# Altium project LPCB220__RLOOP__STEPPER_NODE.PrjPCB (part 1 of 2)
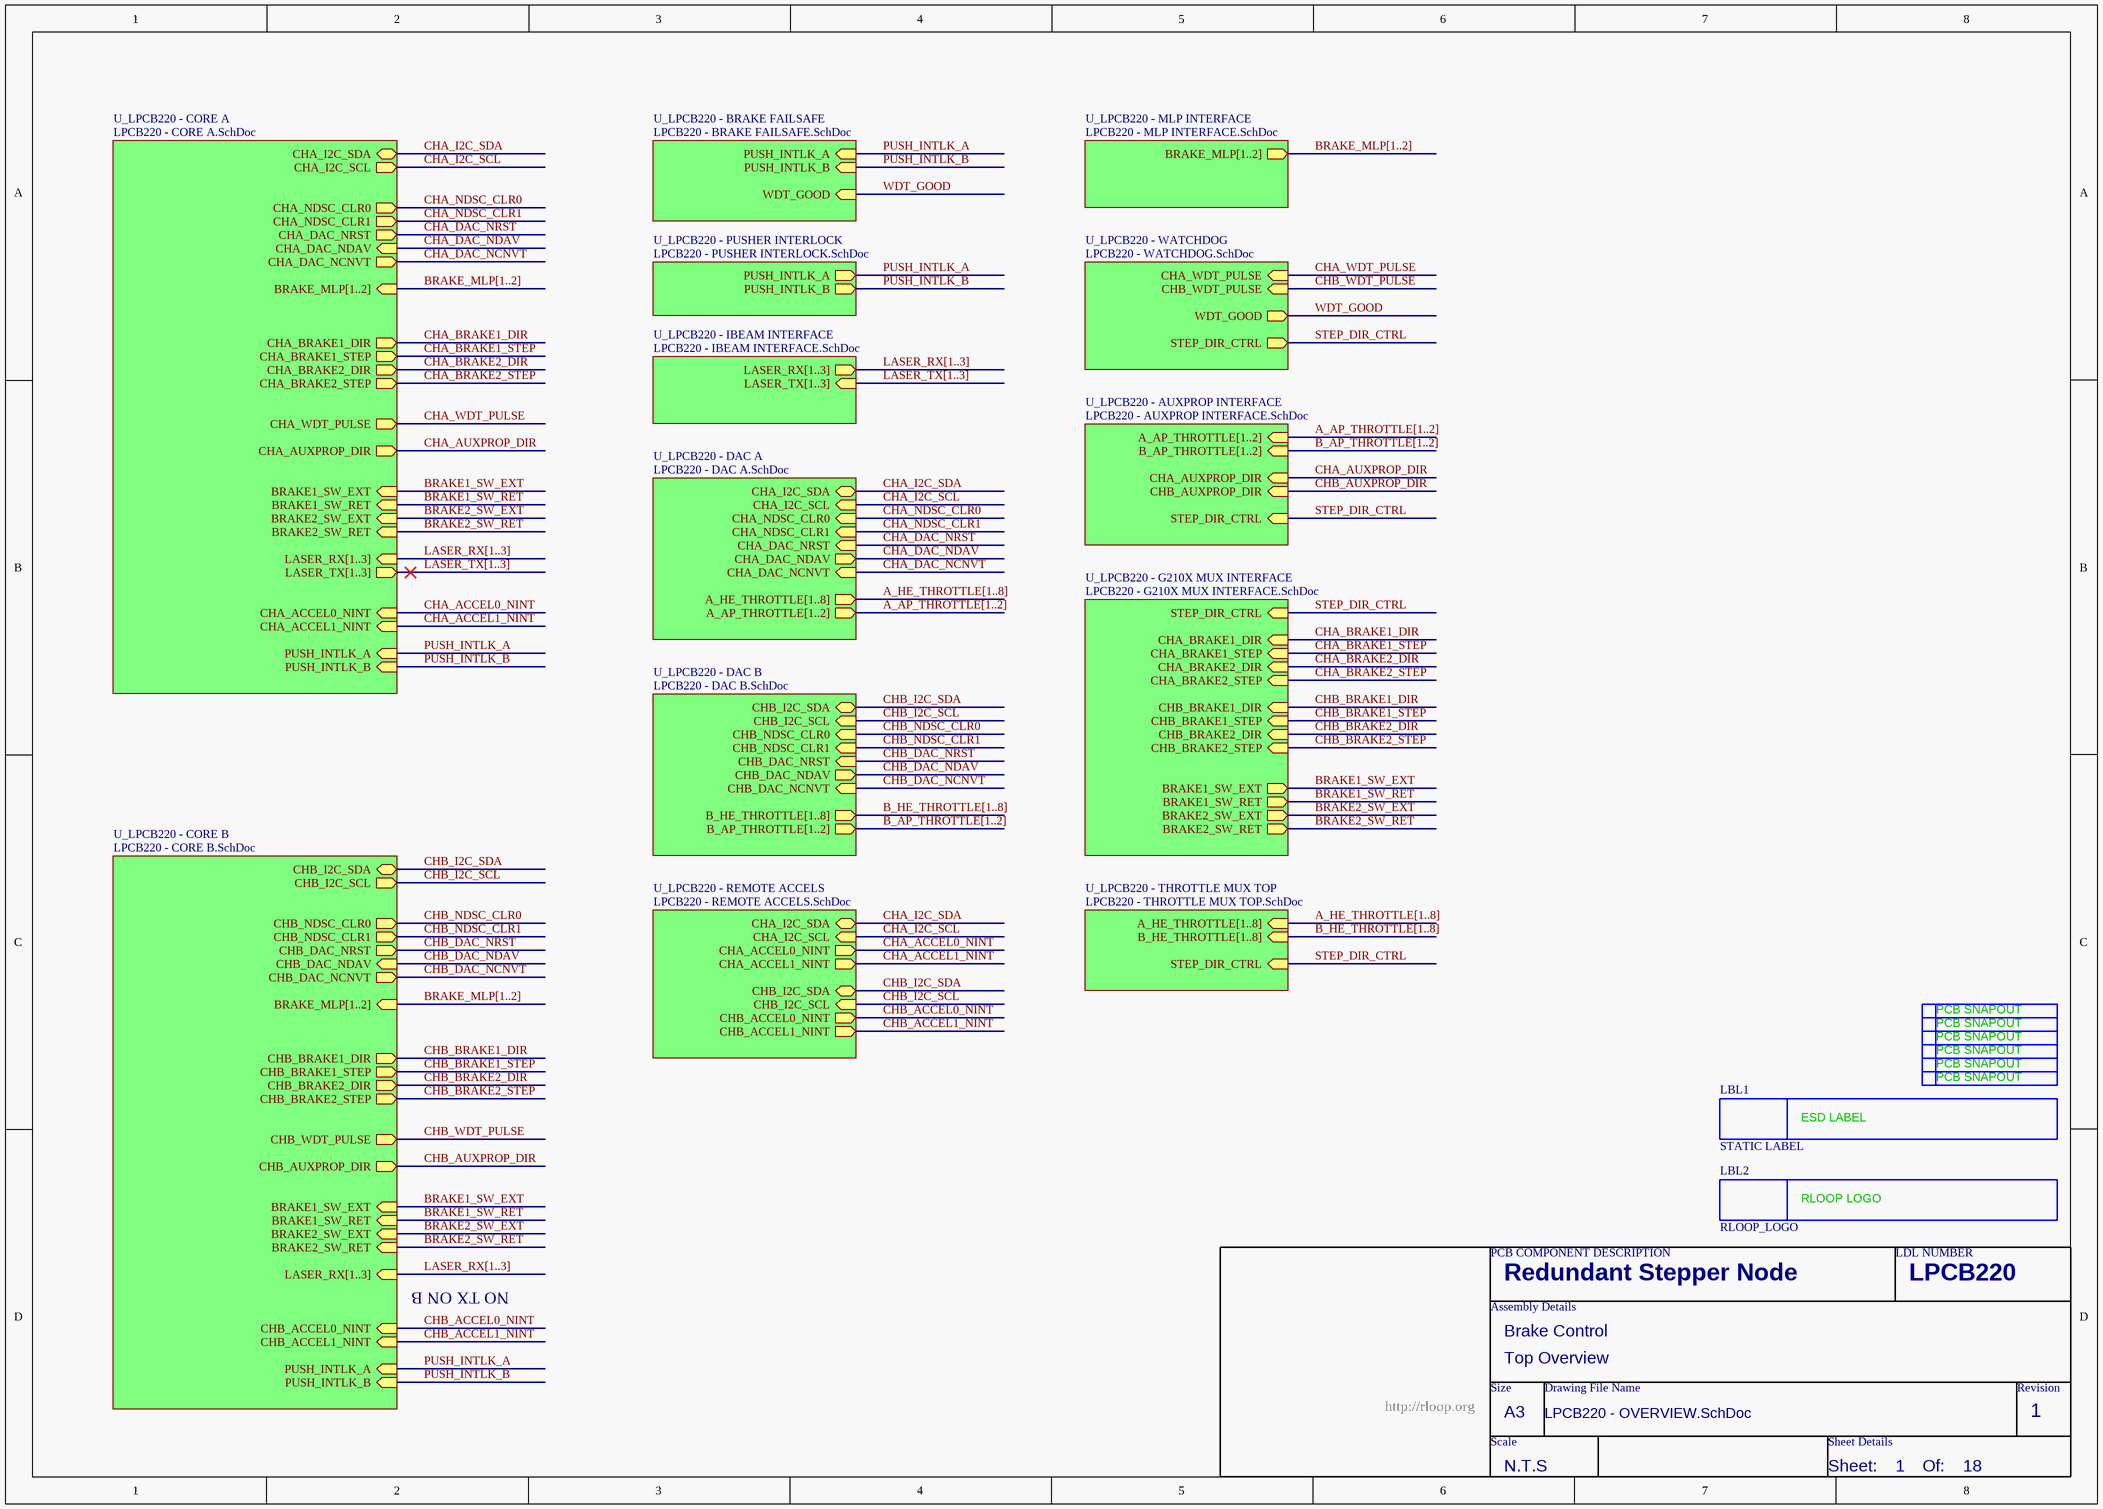
[diagram p0: LPCB220 - OVERVIEW.SchDoc]
18 sheets, 229 parts. Net scope: hierarchical (ports join the sheet entries above them; power ports are global).
Board files: LPCB220R0.PcbDoc, LPCB220R0__ASCII.PcbDoc
Sheets:
  LPCB220 - OVERVIEW.SchDoc
    U_LPCB220 - BRAKE FAILSAFE = LPCB220 - BRAKE FAILSAFE.SchDoc
    U_LPCB220 - WATCHDOG = LPCB220 - WATCHDOG.SchDoc
    U_LPCB220 - MLP INTERFACE = LPCB220 - MLP INTERFACE.SchDoc
      BL1 = LPCB220 - BRAKE MLP CHANNEL.SchDoc
      BL2 = LPCB220 - BRAKE MLP CHANNEL.SchDoc
    U_LPCB220 - PUSHER INTERLOCK = LPCB220 - PUSHER INTERLOCK.SchDoc
    U_LPCB220 - AUXPROP INTERFACE = LPCB220 - AUXPROP INTERFACE.SchDoc
    U_LPCB220 - DAC A = LPCB220 - DAC A.SchDoc
    U_LPCB220 - DAC B = LPCB220 - DAC B.SchDoc
    U_LPCB220 - IBEAM INTERFACE = LPCB220 - IBEAM INTERFACE.SchDoc
      L1 = LPCB220 - LASER CHANNEL.SchDoc
      L2 = LPCB220 - LASER CHANNEL.SchDoc
      L3 = LPCB220 - LASER CHANNEL.SchDoc
    U_LPCB220 - CORE A = LPCB220 - CORE A.SchDoc
    U_LPCB220 - REMOTE ACCELS = LPCB220 - REMOTE ACCELS.SchDoc
    U_LPCB220 - CORE B = LPCB220 - CORE B.SchDoc
    U_LPCB220 - G210X MUX INTERFACE = LPCB220 - G210X MUX INTERFACE.SchDoc
    U_LPCB220 - THROTTLE MUX TOP = LPCB220 - THROTTLE MUX TOP.SchDoc
      TH1 = LPCB220 - THROTTLE ISO CHANNEL.SchDoc
      TH2 = LPCB220 - THROTTLE ISO CHANNEL.SchDoc
      TH3 = LPCB220 - THROTTLE ISO CHANNEL.SchDoc
      TH4 = LPCB220 - THROTTLE ISO CHANNEL.SchDoc
      TH5 = LPCB220 - THROTTLE ISO CHANNEL.SchDoc
      TH6 = LPCB220 - THROTTLE ISO CHANNEL.SchDoc
      TH7 = LPCB220 - THROTTLE ISO CHANNEL.SchDoc
      TH8 = LPCB220 - THROTTLE ISO CHANNEL.SchDoc
      U_LPCB220 - THROTTLE CONNECTORS = LPCB220 - THROTTLE CONNECTORS.SchDoc

## Sheet LPCB220 - OVERVIEW.SchDoc
size A3; Address1: Factory 10; Address2: 9-13 Dingley Avenue, Dandeong, VICTORIA 3175, AUSTRALIA; DocumentNumber: 1; Revision: 1; SheetNumber: 1; SheetTotal: 18; Lockie__PCB_SUB_ASSEMBLY: Top Overview; Lockie__PCB_ASSEMBLY: Brake Control; Lockie__LDL: LPCB220; Lockie__PCB_DESCRIPTION: Redundant Stepper Node

### Parts
LBL1  STATIC LABEL  [STATIC_LABEL]  (no BOM)
LBL2  RLOOP_LOGO  [RLOOP_LOGO]  (no BOM)
SN1  PCB_SNAPOUT  [SNAPOUT_NEW]  (value not drawn)  (no BOM)
SN2  PCB_SNAPOUT  [SNAPOUT_NEW]  (value not drawn)  (no BOM)
SN3  PCB_SNAPOUT  [SNAPOUT_NEW]  (value not drawn)  (no BOM)
SN4  PCB_SNAPOUT  [SNAPOUT_NEW]  (value not drawn)  (no BOM)
SN5  PCB_SNAPOUT  [SNAPOUT_NEW]  (value not drawn)  (no BOM)
SN6  PCB_SNAPOUT  [SNAPOUT_NEW]  (value not drawn)  (no BOM)

### Sub-sheets
U_LPCB220 - AUXPROP INTERFACE = LPCB220 - AUXPROP INTERFACE.SchDoc: B_AP_THROTTLE[1..2] (in), A_AP_THROTTLE[1..2] (in), CHB_AUXPROP_DIR (in), CHA_AUXPROP_DIR (in), STEP_DIR_CTRL (in)
U_LPCB220 - BRAKE FAILSAFE = LPCB220 - BRAKE FAILSAFE.SchDoc: PUSH_INTLK_A (in), PUSH_INTLK_B (in), WDT_GOOD (in)
U_LPCB220 - CORE A = LPCB220 - CORE A.SchDoc: CHA_I2C_SDA (bidir), CHA_I2C_SCL (out), LASER_TX[1..3] (out), LASER_RX[1..3] (in), CHA_ACCEL0_NINT (in), CHA_ACCEL1_NINT (in), CHA_AUXPROP_DIR (out), CHA_DAC_NDAV (in), BRAKE1_SW_EXT (in), BRAKE1_SW_RET (in), BRAKE_MLP[1..2] (in), CHA_NDSC_CLR0 (out), CHA_NDSC_CLR1 (out), BRAKE2_SW_EXT (in), BRAKE2_SW_RET (in), PUSH_INTLK_A (in), PUSH_INTLK_B (in), CHA_WDT_PULSE (out), CHA_BRAKE1_DIR (out), CHA_BRAKE1_STEP (out), CHA_BRAKE2_DIR (out), CHA_BRAKE2_STEP (out), CHA_DAC_NRST (out), CHA_DAC_NCNVT (out)
U_LPCB220 - CORE B = LPCB220 - CORE B.SchDoc: CHB_I2C_SDA (bidir), CHB_I2C_SCL (out), LASER_RX[1..3] (in), CHB_ACCEL0_NINT (in), CHB_ACCEL1_NINT (in), CHB_AUXPROP_DIR (out), CHB_DAC_NDAV (in), BRAKE1_SW_EXT (in), BRAKE1_SW_RET (in), BRAKE_MLP[1..2] (in), CHB_NDSC_CLR0 (out), CHB_NDSC_CLR1 (out), BRAKE2_SW_EXT (in), BRAKE2_SW_RET (in), PUSH_INTLK_A (in), PUSH_INTLK_B (in), CHB_WDT_PULSE (out), CHB_BRAKE1_DIR (out), CHB_BRAKE1_STEP (out), CHB_BRAKE2_DIR (out), CHB_BRAKE2_STEP (out), CHB_DAC_NRST (out), CHB_DAC_NCNVT (out)
U_LPCB220 - DAC A = LPCB220 - DAC A.SchDoc: A_HE_THROTTLE[1..8] (out), A_AP_THROTTLE[1..2] (out), CHA_I2C_SDA (bidir), CHA_I2C_SCL (in), CHA_NDSC_CLR0 (in), CHA_NDSC_CLR1 (in), CHA_DAC_NRST (in), CHA_DAC_NDAV (out), CHA_DAC_NCNVT (in)
U_LPCB220 - DAC B = LPCB220 - DAC B.SchDoc: B_HE_THROTTLE[1..8] (out), B_AP_THROTTLE[1..2] (out), CHB_I2C_SDA (bidir), CHB_I2C_SCL (in), CHB_NDSC_CLR0 (in), CHB_NDSC_CLR1 (in), CHB_DAC_NRST (in), CHB_DAC_NDAV (out), CHB_DAC_NCNVT (in)
U_LPCB220 - G210X MUX INTERFACE = LPCB220 - G210X MUX INTERFACE.SchDoc: CHB_BRAKE1_DIR (in), CHA_BRAKE1_DIR (in), CHB_BRAKE2_DIR (in), CHA_BRAKE2_DIR (in), CHB_BRAKE1_STEP (in), CHA_BRAKE1_STEP (in), CHB_BRAKE2_STEP (in), CHA_BRAKE2_STEP (in), STEP_DIR_CTRL (in), BRAKE1_SW_EXT (out), BRAKE1_SW_RET (out), BRAKE2_SW_EXT (out), BRAKE2_SW_RET (out)
U_LPCB220 - IBEAM INTERFACE = LPCB220 - IBEAM INTERFACE.SchDoc: LASER_TX[1..3] (in), LASER_RX[1..3] (out)
U_LPCB220 - MLP INTERFACE = LPCB220 - MLP INTERFACE.SchDoc: BRAKE_MLP[1..2] (out)
U_LPCB220 - PUSHER INTERLOCK = LPCB220 - PUSHER INTERLOCK.SchDoc: PUSH_INTLK_A (out), PUSH_INTLK_B (out)
U_LPCB220 - REMOTE ACCELS = LPCB220 - REMOTE ACCELS.SchDoc: CHA_I2C_SCL (in), CHA_I2C_SDA (bidir), CHB_ACCEL0_NINT (out), CHA_ACCEL1_NINT (out), CHA_ACCEL0_NINT (out), CHB_ACCEL1_NINT (out), CHB_I2C_SCL (in), CHB_I2C_SDA (bidir)
U_LPCB220 - THROTTLE MUX TOP = LPCB220 - THROTTLE MUX TOP.SchDoc: B_HE_THROTTLE[1..8] (in), A_HE_THROTTLE[1..8] (in), STEP_DIR_CTRL (in)
U_LPCB220 - WATCHDOG = LPCB220 - WATCHDOG.SchDoc: CHA_WDT_PULSE (in), CHB_WDT_PULSE (in), STEP_DIR_CTRL (out), WDT_GOOD (out)

### Nets
BRAKE1_SW_EXT: sheet U_LPCB220 - CORE A/BRAKE1_SW_EXT, sheet U_LPCB220 - CORE B/BRAKE1_SW_EXT, sheet U_LPCB220 - G210X MUX INTERFACE/BRAKE1_SW_EXT
BRAKE1_SW_RET: sheet U_LPCB220 - CORE A/BRAKE1_SW_RET, sheet U_LPCB220 - CORE B/BRAKE1_SW_RET, sheet U_LPCB220 - G210X MUX INTERFACE/BRAKE1_SW_RET
BRAKE2_SW_EXT: sheet U_LPCB220 - CORE A/BRAKE2_SW_EXT, sheet U_LPCB220 - CORE B/BRAKE2_SW_EXT, sheet U_LPCB220 - G210X MUX INTERFACE/BRAKE2_SW_EXT
BRAKE2_SW_RET: sheet U_LPCB220 - CORE A/BRAKE2_SW_RET, sheet U_LPCB220 - CORE B/BRAKE2_SW_RET, sheet U_LPCB220 - G210X MUX INTERFACE/BRAKE2_SW_RET
CHA_ACCEL0_NINT: sheet U_LPCB220 - CORE A/CHA_ACCEL0_NINT, sheet U_LPCB220 - REMOTE ACCELS/CHA_ACCEL0_NINT
CHA_ACCEL1_NINT: sheet U_LPCB220 - CORE A/CHA_ACCEL1_NINT, sheet U_LPCB220 - REMOTE ACCELS/CHA_ACCEL1_NINT
CHA_AUXPROP_DIR: sheet U_LPCB220 - AUXPROP INTERFACE/CHA_AUXPROP_DIR, sheet U_LPCB220 - CORE A/CHA_AUXPROP_DIR
CHA_BRAKE1_DIR: sheet U_LPCB220 - CORE A/CHA_BRAKE1_DIR, sheet U_LPCB220 - G210X MUX INTERFACE/CHA_BRAKE1_DIR
CHA_BRAKE1_STEP: sheet U_LPCB220 - CORE A/CHA_BRAKE1_STEP, sheet U_LPCB220 - G210X MUX INTERFACE/CHA_BRAKE1_STEP
CHA_BRAKE2_DIR: sheet U_LPCB220 - CORE A/CHA_BRAKE2_DIR, sheet U_LPCB220 - G210X MUX INTERFACE/CHA_BRAKE2_DIR
CHA_BRAKE2_STEP: sheet U_LPCB220 - CORE A/CHA_BRAKE2_STEP, sheet U_LPCB220 - G210X MUX INTERFACE/CHA_BRAKE2_STEP
CHA_DAC_NCNVT: sheet U_LPCB220 - DAC A/CHA_DAC_NCNVT, sheet U_LPCB220 - CORE A/CHA_DAC_NCNVT
CHA_DAC_NDAV: sheet U_LPCB220 - DAC A/CHA_DAC_NDAV, sheet U_LPCB220 - CORE A/CHA_DAC_NDAV
CHA_DAC_NRST: sheet U_LPCB220 - DAC A/CHA_DAC_NRST, sheet U_LPCB220 - CORE A/CHA_DAC_NRST
CHA_I2C_SCL: sheet U_LPCB220 - DAC A/CHA_I2C_SCL, sheet U_LPCB220 - CORE A/CHA_I2C_SCL, sheet U_LPCB220 - REMOTE ACCELS/CHA_I2C_SCL
CHA_I2C_SDA: sheet U_LPCB220 - DAC A/CHA_I2C_SDA, sheet U_LPCB220 - CORE A/CHA_I2C_SDA, sheet U_LPCB220 - REMOTE ACCELS/CHA_I2C_SDA
CHA_NDSC_CLR0: sheet U_LPCB220 - DAC A/CHA_NDSC_CLR0, sheet U_LPCB220 - CORE A/CHA_NDSC_CLR0
CHA_NDSC_CLR1: sheet U_LPCB220 - DAC A/CHA_NDSC_CLR1, sheet U_LPCB220 - CORE A/CHA_NDSC_CLR1
CHA_WDT_PULSE: sheet U_LPCB220 - WATCHDOG/CHA_WDT_PULSE, sheet U_LPCB220 - CORE A/CHA_WDT_PULSE
CHB_ACCEL0_NINT: sheet U_LPCB220 - REMOTE ACCELS/CHB_ACCEL0_NINT, sheet U_LPCB220 - CORE B/CHB_ACCEL0_NINT
CHB_ACCEL1_NINT: sheet U_LPCB220 - REMOTE ACCELS/CHB_ACCEL1_NINT, sheet U_LPCB220 - CORE B/CHB_ACCEL1_NINT
CHB_AUXPROP_DIR: sheet U_LPCB220 - AUXPROP INTERFACE/CHB_AUXPROP_DIR, sheet U_LPCB220 - CORE B/CHB_AUXPROP_DIR
CHB_BRAKE1_DIR: sheet U_LPCB220 - CORE B/CHB_BRAKE1_DIR, sheet U_LPCB220 - G210X MUX INTERFACE/CHB_BRAKE1_DIR
CHB_BRAKE1_STEP: sheet U_LPCB220 - CORE B/CHB_BRAKE1_STEP, sheet U_LPCB220 - G210X MUX INTERFACE/CHB_BRAKE1_STEP
CHB_BRAKE2_DIR: sheet U_LPCB220 - CORE B/CHB_BRAKE2_DIR, sheet U_LPCB220 - G210X MUX INTERFACE/CHB_BRAKE2_DIR
CHB_BRAKE2_STEP: sheet U_LPCB220 - CORE B/CHB_BRAKE2_STEP, sheet U_LPCB220 - G210X MUX INTERFACE/CHB_BRAKE2_STEP
CHB_DAC_NCNVT: sheet U_LPCB220 - DAC B/CHB_DAC_NCNVT, sheet U_LPCB220 - CORE B/CHB_DAC_NCNVT
CHB_DAC_NDAV: sheet U_LPCB220 - DAC B/CHB_DAC_NDAV, sheet U_LPCB220 - CORE B/CHB_DAC_NDAV
CHB_DAC_NRST: sheet U_LPCB220 - DAC B/CHB_DAC_NRST, sheet U_LPCB220 - CORE B/CHB_DAC_NRST
CHB_I2C_SCL: sheet U_LPCB220 - DAC B/CHB_I2C_SCL, sheet U_LPCB220 - REMOTE ACCELS/CHB_I2C_SCL, sheet U_LPCB220 - CORE B/CHB_I2C_SCL
CHB_I2C_SDA: sheet U_LPCB220 - DAC B/CHB_I2C_SDA, sheet U_LPCB220 - REMOTE ACCELS/CHB_I2C_SDA, sheet U_LPCB220 - CORE B/CHB_I2C_SDA
CHB_NDSC_CLR0: sheet U_LPCB220 - DAC B/CHB_NDSC_CLR0, sheet U_LPCB220 - CORE B/CHB_NDSC_CLR0
CHB_NDSC_CLR1: sheet U_LPCB220 - DAC B/CHB_NDSC_CLR1, sheet U_LPCB220 - CORE B/CHB_NDSC_CLR1
CHB_WDT_PULSE: sheet U_LPCB220 - WATCHDOG/CHB_WDT_PULSE, sheet U_LPCB220 - CORE B/CHB_WDT_PULSE
PUSH_INTLK_A: sheet U_LPCB220 - BRAKE FAILSAFE/PUSH_INTLK_A, sheet U_LPCB220 - PUSHER INTERLOCK/PUSH_INTLK_A, sheet U_LPCB220 - CORE A/PUSH_INTLK_A, sheet U_LPCB220 - CORE B/PUSH_INTLK_A
PUSH_INTLK_B: sheet U_LPCB220 - BRAKE FAILSAFE/PUSH_INTLK_B, sheet U_LPCB220 - PUSHER INTERLOCK/PUSH_INTLK_B, sheet U_LPCB220 - CORE A/PUSH_INTLK_B, sheet U_LPCB220 - CORE B/PUSH_INTLK_B
STEP_DIR_CTRL: sheet U_LPCB220 - WATCHDOG/STEP_DIR_CTRL, sheet U_LPCB220 - AUXPROP INTERFACE/STEP_DIR_CTRL, sheet U_LPCB220 - G210X MUX INTERFACE/STEP_DIR_CTRL, sheet U_LPCB220 - THROTTLE MUX TOP/STEP_DIR_CTRL
WDT_GOOD: sheet U_LPCB220 - BRAKE FAILSAFE/WDT_GOOD, sheet U_LPCB220 - WATCHDOG/WDT_GOOD

### Buses and harness runs
bus A_AP_THROTTLE[1..2] = sheet U_LPCB220 - AUXPROP INTERFACE/A_AP_THROTTLE[1..2]
bus A_AP_THROTTLE[1..2] = sheet U_LPCB220 - DAC A/A_AP_THROTTLE[1..2]
bus A_HE_THROTTLE[1..8] = sheet U_LPCB220 - DAC A/A_HE_THROTTLE[1..8]
bus A_HE_THROTTLE[1..8] = sheet U_LPCB220 - THROTTLE MUX TOP/A_HE_THROTTLE[1..8]
bus B_AP_THROTTLE[1..2] = sheet U_LPCB220 - AUXPROP INTERFACE/B_AP_THROTTLE[1..2]
bus B_AP_THROTTLE[1..2] = sheet U_LPCB220 - DAC B/B_AP_THROTTLE[1..2]
bus B_HE_THROTTLE[1..8] = sheet U_LPCB220 - DAC B/B_HE_THROTTLE[1..8]
bus B_HE_THROTTLE[1..8] = sheet U_LPCB220 - THROTTLE MUX TOP/B_HE_THROTTLE[1..8]
bus BRAKE_MLP[1..2] = sheet U_LPCB220 - CORE A/BRAKE_MLP[1..2]
bus BRAKE_MLP[1..2] = sheet U_LPCB220 - CORE B/BRAKE_MLP[1..2]
bus BRAKE_MLP[1..2] = sheet U_LPCB220 - MLP INTERFACE/BRAKE_MLP[1..2]
bus LASER_RX[1..3] = sheet U_LPCB220 - CORE A/LASER_RX[1..3]
bus LASER_RX[1..3] = sheet U_LPCB220 - CORE B/LASER_RX[1..3]
bus LASER_RX[1..3] = sheet U_LPCB220 - IBEAM INTERFACE/LASER_RX[1..3]
bus LASER_TX[1..3] = sheet U_LPCB220 - CORE A/LASER_TX[1..3]
bus LASER_TX[1..3] = sheet U_LPCB220 - IBEAM INTERFACE/LASER_TX[1..3]

### Notes on the sheet
- NO TX ON B
- PCB COMPONENT DESCRIPTION
- LDL NUMBER
- Assembly Details
- Size
- Drawing File Name
- Revision
- http://rloop.org
- Scale
- A3
- Sheet Details
- N.T.S
- Sheet:
- Of:
- (in symbol PCB_SNAPOUT) PCB SNAPOUT
- (in symbol RLOOP_LOGO) RLOOP LOGO
- (in symbol STATIC LABEL) ESD LABEL

### Library data of the parts
LBL1 = STATIC LABEL: FMEDA__CHANNEL: DIAG; FMEDA__FUNCTION_IN_SYSTEM: *
LBL2 = RLOOP_LOGO: FMEDA__CHANNEL: DIAG; FMEDA__FUNCTION_IN_SYSTEM: *
SN1-SN6 = PCB_SNAPOUT: FMEDA__CHANNEL: DIAG; FMEDA__FUNCTION_IN_SYSTEM: *

## Sheet LPCB220 - BRAKE FAILSAFE.SchDoc
size A3; Address1: Factory 10; Address2: 9-13 Dingley Avenue, Dandeong, VICTORIA 3175, AUSTRALIA; DocumentNumber: 3; Revision: 1; SheetNumber: 3; SheetTotal: 18; Lockie__PCB_SUB_ASSEMBLY: Brake Failsafe Selection; Lockie__PCB_ASSEMBLY: Brake Control; Lockie__LDL: LPCB220; Lockie__PCB_DESCRIPTION: Redundant Stepper Node
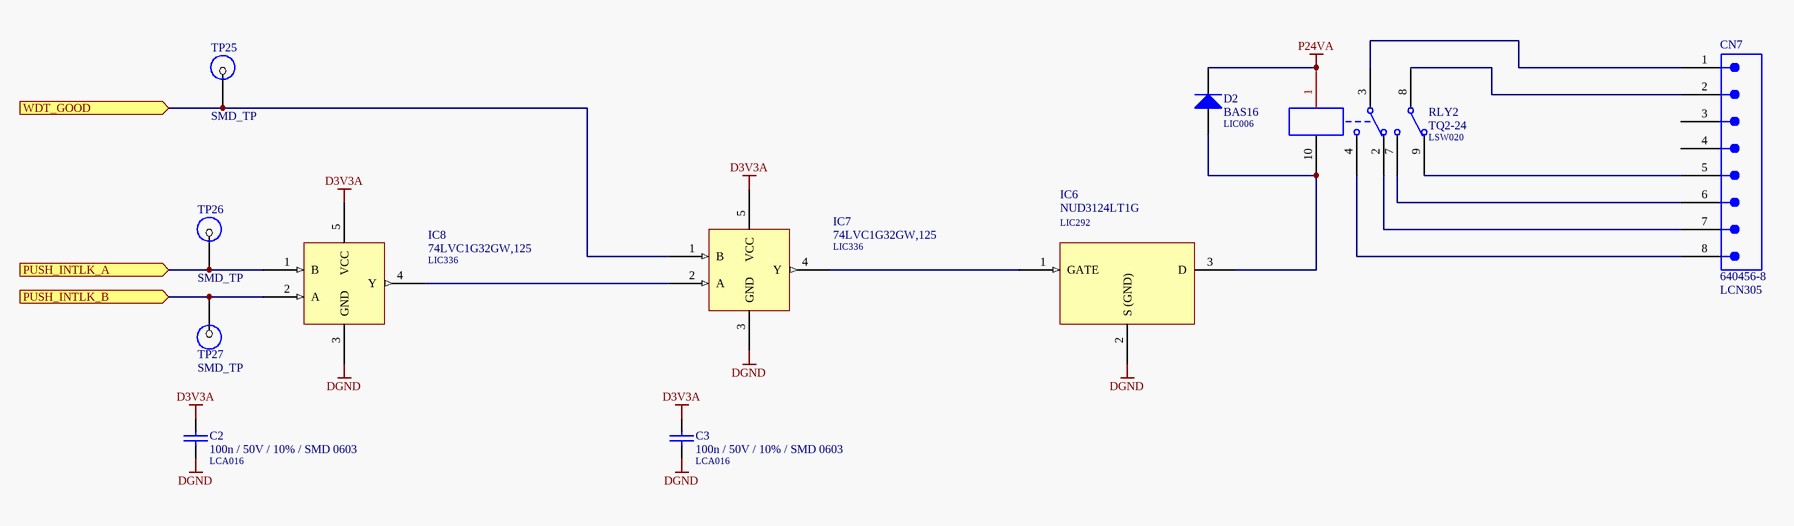
[diagram p1: LPCB220 - BRAKE FAILSAFE.SchDoc]

### Parts
C2  100n / 50V / 10% / SMD 0603  LDL_NUMBER: LCA016  [LFP011__CC1608-0603-IPC7351_B]
C3  100n / 50V / 10% / SMD 0603  LDL_NUMBER: LCA016  [LFP011__CC1608-0603-IPC7351_B]
CN7  640456-8  LDL_NUMBER: LCN305  [640456-8]
D2  BAS16  LDL_NUMBER: LIC006  [LFP021__SOT23]
IC6  NUD3124LT1G  LDL_NUMBER: LIC292  [LFP021__SOT23]
IC7  74LVC1G32GW,125  LDL_NUMBER: LIC336  [LFP047__SOT353]
IC8  74LVC1G32GW,125  LDL_NUMBER: LIC336  [LFP047__SOT353]
RLY2  TQ2-24  LDL_NUMBER: LSW020  [TQ2]
TP25  SMD_TP  [SMD-TP]  (no BOM)
TP26  SMD_TP  [SMD-TP]  (no BOM)
TP27  SMD_TP  [SMD-TP]  (no BOM)

### Ports
PUSH_INTLK_A (in), PUSH_INTLK_B (in), WDT_GOOD (in)

### Nets
D3V3A: C2.1 C3.1 IC7.5(VCC) IC8.5(VCC)
DGND: C2.2 C3.2 IC6.2(S_(GND)) IC7.3(GND) IC8.3(GND)
P24VA: D2.3(K) RLY2.1
PUSH_INTLK_A: IC8.1(B) TP26.1 ; port PUSH_INTLK_A
PUSH_INTLK_B: IC8.2(A) TP27.1 ; port PUSH_INTLK_B
WDT_GOOD: IC7.1(B) TP25.1 ; port WDT_GOOD
NetCN7_1: CN7.1 RLY2.3
NetCN7_2: CN7.2 RLY2.8
NetCN7_5: CN7.5 RLY2.9
NetCN7_6: CN7.6 RLY2.7
NetCN7_7: CN7.7 RLY2.2
NetCN7_8: CN7.8 RLY2.4
NetD2_1: D2.1(A) IC6.3(D) RLY2.10
NetIC6_1: IC6.1(GATE) IC7.4(Y)
NetIC7_2: IC7.2(A) IC8.4(Y)

Not connected (* = marked no-connect by the designer): CN7 3 4

### Notes on the sheet
- PCB COMPONENT DESCRIPTION
- LDL NUMBER
- Assembly Details
- Size
- Drawing File Name
- Revision
- http://rloop.org
- Scale
- A3
- Sheet Details
- N.T.S
- Sheet:
- Of:

### Library data of the parts
C2 C3 = 100n / 50V / 10% / SMD 0603: Capacitor, Ceramic Chip, 100nF (0.1uF), 50V, 5%, SMD 0603 [LCA016]; FMEDA__OPERATING__VOLTAGE_MIN: 0; FMEDA__OPERATING__VOLTAGE_MAX: 3.3; FMEDA__OPERATING__TEMP_MIN: -20; FMEDA__OPERATING__TEMP_TYP: 27; FMEDA__OPERATING__TEMP_MAX: 50; FMEDA__CHANNEL: COM; Value: 100n; FMEDA__FUNCTION_IN_SYSTEM: *; FMEDA__OPERATING__VOLTAGE_TYP: 3.3
CN7 = 640456-8: Connector, Male Header, 8 Way; FMEDA__CHANNEL: COM; FMEDA__OPERATING__CURRENT_MAX: 0; FMEDA__OPERATING__TEMP_MAX: 50; FMEDA__OPERATING__TEMP_MIN: -20; FMEDA__OPERATING__TEMP_TYP: 27; FMEDA__OPERATING__VOLTAGE_MAX: 16; FMEDA__OPERATING__VOLTAGE_TYP: 12; FMEDA__FUNCTION_IN_SYSTEM: *; FMEDA__OPERATING__CURRENT_MIN: 0; FMEDA__OPERATING__CURRENT_TYP: 0; FMEDA__OPERATING__VOLTAGE_MIN: 0
D2 = BAS16: Diode, Small Signal, 0.2A, 85V, SMD SOT-23 [LIC006]; FMEDA__OPERATING__CURRENT_MIN: 0; FMEDA__OPERATING__TEMP_MIN: -20; FMEDA__OPERATING__TEMP_TYP: 27; FMEDA__OPERATING__TEMP_MAX: 50; FMEDA__CHANNEL: COM; FMEDA__OPERATING__CURRENT_MAX: 0; FMEDA__OPERATING__VOLTAGE_MIN: 0; FMEDA__OPERATING__VOLTAGE_MAX: 0; FMEDA__FUNCTION_IN_SYSTEM: *; FMEDA__OPERATING__CURRENT_TYP: 0; FMEDA__OPERATING__VOLTAGE_TYP: 0
IC6 = NUD3124LT1G: IC, Relay Driver, 28V Industrial, SMD SOT23 [LIC292]; FMEDA__OPERATING__TEMP_MIN: -20; FMEDA__OPERATING__TEMP_TYP: 27; FMEDA__OPERATING__TEMP_MAX: 50; FMEDA__OPERATING__VOLTAGE_MIN: 0; FMEDA__OPERATING__VOLTAGE_TYP: 13; FMEDA__OPERATING__VOLTAGE_MAX: 18; FMEDA__OPERATING__POWER_TYP: 0.1; FMEDA__OPERATING__POWER_MAX: 0.15; FMEDA__CHANNEL: COM; FMEDA__FUNCTION_IN_SYSTEM: *; FMEDA__OPERATING__POWER_MIN: 0
IC7 IC8 = 74LVC1G32GW,125: IC, Logic OR Gate, Single 2 Input, SMD SOT353 [LIC336]; FMEDA__OPERATING__TEMP_MAX: 50; FMEDA__OPERATING__TEMP_MIN: -20; FMEDA__OPERATING__TEMP_TYP: 27; FMEDA__OPERATING__VOLTAGE_MAX: 0; FMEDA__CHANNEL: COM; FMEDA__FUNCTION_IN_SYSTEM: *; FMEDA__OPERATING__VOLTAGE_MIN: 0; FMEDA__OPERATING__VOLTAGE_TYP: 0
RLY2 = TQ2-24: Relay, DPDT, Non Latching, 24VDC Coil, 1A Rating, PTH; FMEDA__CHANNEL: COM; FMEDA__OPERATING__TEMP_MAX: 50; FMEDA__OPERATING__TEMP_MIN: -20; FMEDA__OPERATING__TEMP_TYP: 27; Revision: July-2002: Re-released for DXP Platform.
TP25-TP27 = SMD_TP: SMD Test Point; FMEDA__CHANNEL: COM; FMEDA__OPERATING__CURRENT_MAX: 0; FMEDA__OPERATING__TEMP_MAX: 50; FMEDA__OPERATING__TEMP_MIN: -20; FMEDA__OPERATING__TEMP_TYP: 27; FMEDA__OPERATING__VOLTAGE_MAX: 16; FMEDA__OPERATING__VOLTAGE_TYP: 12; FMEDA__OPERATING__CURRENT_MIN: 0; FMEDA__OPERATING__CURRENT_TYP: 0; FMEDA__OPERATING__VOLTAGE_MIN: 0

## Sheet LPCB220 - WATCHDOG.SchDoc
size A3; Address1: Factory 10; Address2: 9-13 Dingley Avenue, Dandeong, VICTORIA 3175, AUSTRALIA; DocumentNumber: 18; Revision: 1; SheetNumber: 18; SheetTotal: 18; Lockie__PCB_SUB_ASSEMBLY: Watchdog; Lockie__PCB_ASSEMBLY: Brake Control; Lockie__LDL: LPCB220; Lockie__PCB_DESCRIPTION: Redundant Stepper Node
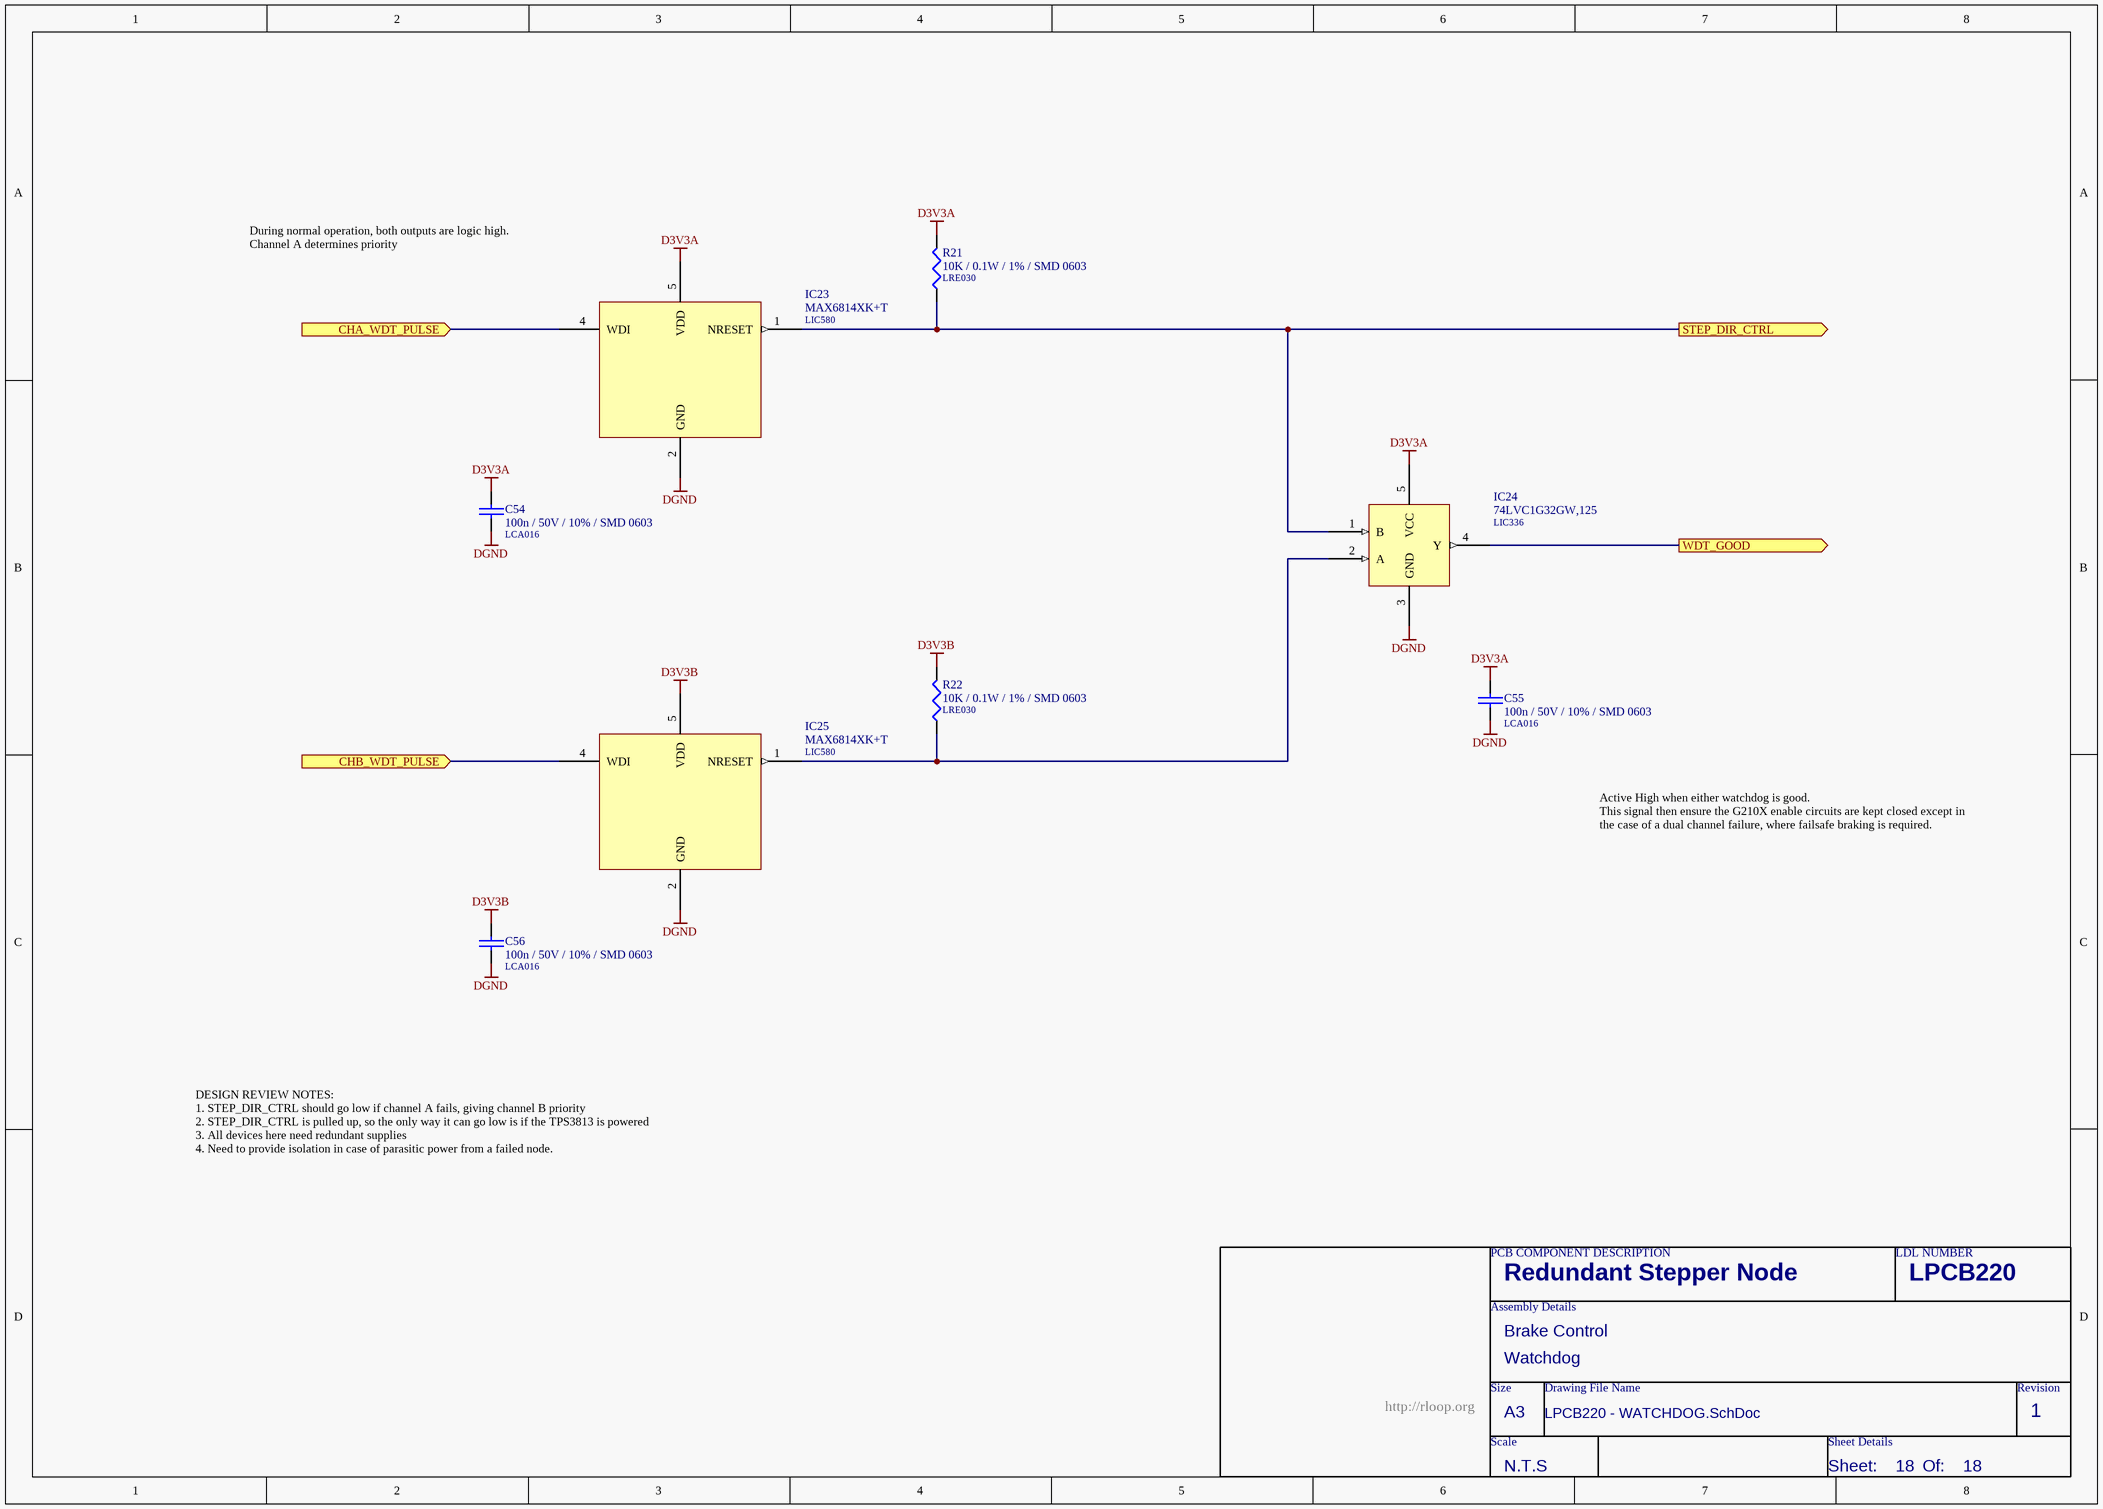
[diagram p2: LPCB220 - WATCHDOG.SchDoc]

### Parts
C54  100n / 50V / 10% / SMD 0603  LDL_NUMBER: LCA016  [LFP011__CC1608-0603-IPC7351_B]
C55  100n / 50V / 10% / SMD 0603  LDL_NUMBER: LCA016  [LFP011__CC1608-0603-IPC7351_B]
C56  100n / 50V / 10% / SMD 0603  LDL_NUMBER: LCA016  [LFP011__CC1608-0603-IPC7351_B]
IC23  MAX6814XK+T  LDL_NUMBER: LIC580  [LFP047__SOT353]
IC24  74LVC1G32GW,125  LDL_NUMBER: LIC336  [LFP047__SOT353]
IC25  MAX6814XK+T  LDL_NUMBER: LIC580  [LFP047__SOT353]
R21  10K / 0.1W / 1% / SMD 0603  LDL_NUMBER: LRE030  [LFP020__CR1608-0603-IPC7351_B]
R22  10K / 0.1W / 1% / SMD 0603  LDL_NUMBER: LRE030  [LFP020__CR1608-0603-IPC7351_B]

### Ports
CHA_WDT_PULSE (in), CHB_WDT_PULSE (in), STEP_DIR_CTRL (out), WDT_GOOD (out)

### Nets
D3V3A: C54.1 C55.1 IC23.5(VDD) IC24.5(VCC) R21.2
D3V3B: C56.1 IC25.5(VDD) R22.2
DGND: C54.2 C55.2 C56.2 IC23.2(GND) IC24.3(GND) IC25.2(GND)
CHA_WDT_PULSE: IC23.4(WDI) ; port CHA_WDT_PULSE
CHB_WDT_PULSE: IC25.4(WDI) ; port CHB_WDT_PULSE
STEP_DIR_CTRL: IC23.1(NRESET) IC24.1(B) R21.1 ; port STEP_DIR_CTRL
WDT_GOOD: IC24.4(Y) ; port WDT_GOOD
NetIC24_2: IC24.2(A) IC25.1(NRESET) R22.1

### Notes on the sheet
- During normal operation, both outputs are logic high.
  Channel A determines priority
- Active High when either watchdog is good.
  This signal then ensure the G210X enable circuits are kept closed except in
  the case of a dual channel failure, where failsafe braking is required.
- DESIGN REVIEW NOTES:
  1. STEP_DIR_CTRL should go low if channel A fails, giving channel B priority
  2. STEP_DIR_CTRL is pulled up, so the only way it can go low is if the TPS3813 is powered
  3. All devices here need redundant supplies
  4. Need to provide isolation in case of parasitic power from a failed node.
- PCB COMPONENT DESCRIPTION
- LDL NUMBER
- Assembly Details
- Size
- Drawing File Name
- Revision
- http://rloop.org
- Scale
- A3
- Sheet Details
- N.T.S
- Sheet:
- Of:

### Library data of the parts
C54-C56 = 100n / 50V / 10% / SMD 0603: as C2 on sheet LPCB220 - BRAKE FAILSAFE; Value: 100n; FMEDA__FUNCTION_IN_SYSTEM: *; FMEDA__OPERATING__VOLTAGE_TYP: 3.3
IC23 IC25 = MAX6814XK+T: IC, Watchdog, SMD [LIC580]; FMEDA__OPERATING__TEMP_MIN: -20; FMEDA__OPERATING__TEMP_TYP: 27; FMEDA__OPERATING__TEMP_MAX: 50; FMEDA__OPERATING__VOLTAGE_MIN: 0; FMEDA__OPERATING__VOLTAGE_TYP: 3.3; FMEDA__CHANNEL: COM; FMEDA__FUNCTION_IN_SYSTEM: *; FMEDA__OPERATING__VOLTAGE_MAX: 3.3
IC24 = 74LVC1G32GW,125: as IC7 on sheet LPCB220 - BRAKE FAILSAFE; FMEDA__FUNCTION_IN_SYSTEM: *; FMEDA__OPERATING__VOLTAGE_MIN: 0; FMEDA__OPERATING__VOLTAGE_TYP: 0
R21 R22 = 10K / 0.1W / 1% / SMD 0603: Resistor, Ceramic Chip, 10K, 0.1W, 1%, SMD 0603 [LRE030]; FMEDA__OPERATING__POWER_MAX: 0; FMEDA__OPERATING__TEMP_MAX: 50; FMEDA__OPERATING__TEMP_MIN: -20; FMEDA__OPERATING__TEMP_TYP: 27; FMEDA__CHANNEL: COM; Value: 10K; FMEDA__OPERATING__POWER_MIN: 0; FMEDA__OPERATING__VOLTAGE_MAX: 0; FMEDA__OPERATING__VOLTAGE_MIN: 0; FMEDA__OPERATING__VOLTAGE_TYP: 0; FMEDA__FUNCTION_IN_SYSTEM: *

## Sheet LPCB220 - MLP INTERFACE.SchDoc
size A3; Address1: Factory 10; Address2: 9-13 Dingley Avenue, Dandeong, VICTORIA 3175, AUSTRALIA; DocumentNumber: 11; Revision: 1; SheetNumber: 11; SheetTotal: 18; Lockie__PCB_SUB_ASSEMBLY: MLP Top Level; Lockie__PCB_ASSEMBLY: Brake Control; Lockie__LDL: LPCB220; Lockie__PCB_DESCRIPTION: Redundant Stepper Node
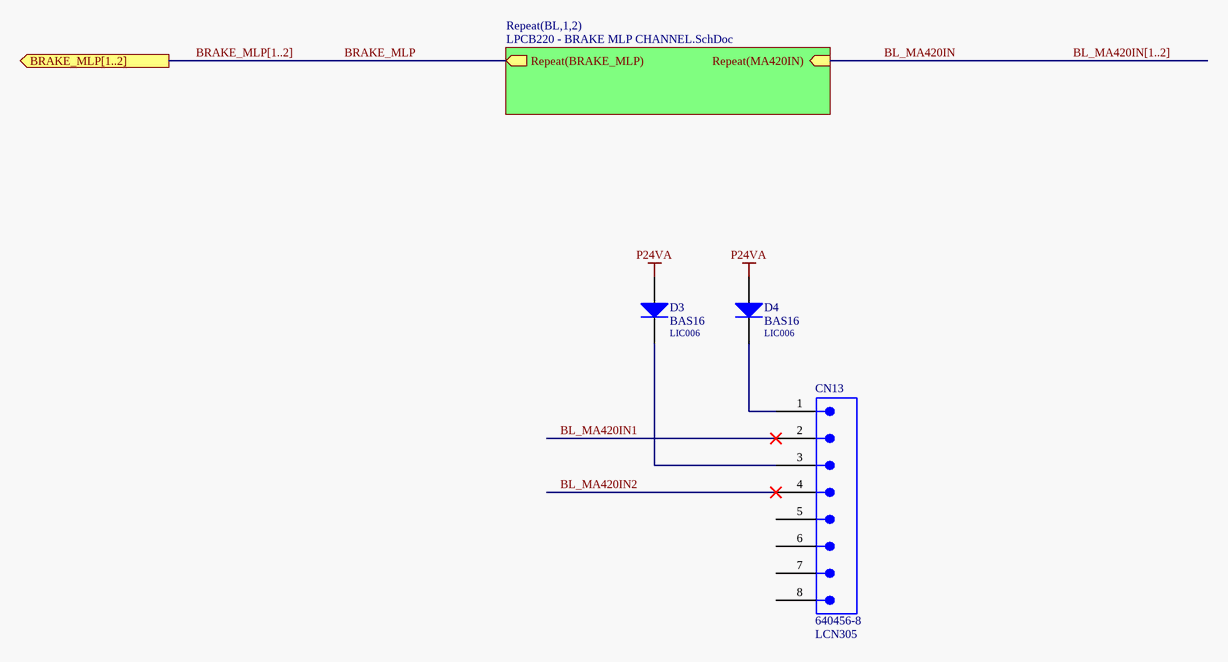
[diagram p3: LPCB220 - MLP INTERFACE.SchDoc]

### Parts
CN13  640456-8  LDL_NUMBER: LCN305  [640456-8]
D3  BAS16  LDL_NUMBER: LIC006  [LFP021__SOT23]
D4  BAS16  LDL_NUMBER: LIC006  [LFP021__SOT23]

### Sub-sheets
Repeat(BL,1,2) = LPCB220 - BRAKE MLP CHANNEL.SchDoc: Repeat(MA420IN) (in), Repeat(BRAKE_MLP) (out)

### Ports
BRAKE_MLP[1..2] (out)

### Nets
P24VA: D3.1(A) D4.1(A)
BL_MA420IN: sheet Repeat(BL,1,2)/Repeat(MA420IN)
BL_MA420IN1: CN13.2
BL_MA420IN2: CN13.4
BRAKE_MLP: sheet Repeat(BL,1,2)/Repeat(BRAKE_MLP)
NetCN13_1: CN13.1 D4.3(K)
NetCN13_3: CN13.3 D3.3(K)

Not connected (* = marked no-connect by the designer): CN13 5 6 7 8

### Buses and harness runs
bus BL_MA420IN[1..2]
bus BRAKE_MLP[1..2] = port BRAKE_MLP[1..2]

### Notes on the sheet
- PCB COMPONENT DESCRIPTION
- LDL NUMBER
- Assembly Details
- Size
- Drawing File Name
- Revision
- http://rloop.org
- Scale
- A3
- Sheet Details
- N.T.S
- Sheet:
- Of:

### Library data of the parts
CN13 = 640456-8: as CN7 on sheet LPCB220 - BRAKE FAILSAFE; FMEDA__FUNCTION_IN_SYSTEM: *; FMEDA__OPERATING__CURRENT_MIN: 0; FMEDA__OPERATING__CURRENT_TYP: 0; FMEDA__OPERATING__VOLTAGE_MIN: 0
D3 D4 = BAS16: as D2 on sheet LPCB220 - BRAKE FAILSAFE; FMEDA__OPERATING__CURRENT_MAX: 0; FMEDA__OPERATING__VOLTAGE_MIN: 0; FMEDA__OPERATING__VOLTAGE_MAX: 0; FMEDA__FUNCTION_IN_SYSTEM: *; FMEDA__OPERATING__CURRENT_TYP: 0; FMEDA__OPERATING__VOLTAGE_TYP: 0

## Sheet LPCB220 - BRAKE MLP CHANNEL.SchDoc
size A3; Address1: Factory 10; Address2: 9-13 Dingley Avenue, Dandeong, VICTORIA 3175, AUSTRALIA; DocumentNumber: 12; Revision: 1; SheetNumber: 12; SheetTotal: 18; Lockie__PCB_SUB_ASSEMBLY: MLP Input Channel; Lockie__PCB_ASSEMBLY: Brake Control; Lockie__LDL: LPCB220; Lockie__PCB_DESCRIPTION: Redundant Stepper Node
Used 2 times, as channels U_LPCB220 - MLP INTERFACE/BL1, U_LPCB220 - MLP INTERFACE/BL2. Parts and nets are listed once, with the designators drawn on the sheet.
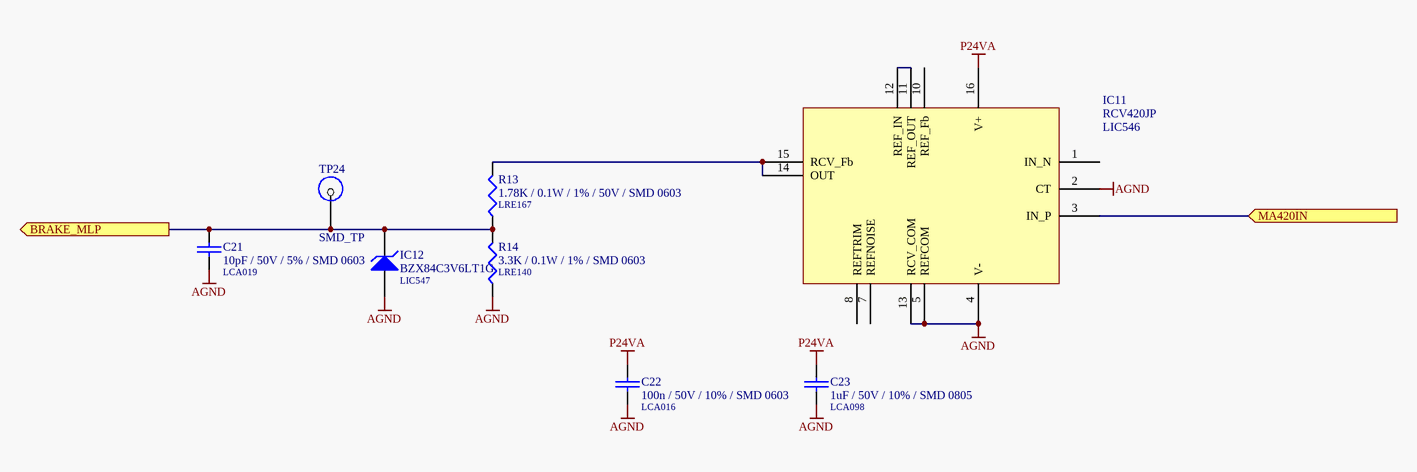
[diagram p4: LPCB220 - BRAKE MLP CHANNEL.SchDoc]

### Parts
C21  10pF / 50V / 5% / SMD 0603  LDL_NUMBER: LCA019  [LFP011__CC1608-0603-IPC7351_B]
C22  100n / 50V / 10% / SMD 0603  LDL_NUMBER: LCA016  [LFP011__CC1608-0603-IPC7351_B]
C23  1uF / 50V / 10% / SMD 0805  LDL_NUMBER: LCA098  [LFP010__CC2012-0805-IPC7351_B]
IC11  RCV420JP  LDL_NUMBER: LIC546  [DIP-P16/X1.5]
IC12  BZX84C3V6LT1G  LDL_NUMBER: LIC547  [LFP021__SOT23]
R13  1.78K / 0.1W / 1% / 50V / SMD 0603  LDL_NUMBER: LRE167  [LFP020__CR1608-0603-IPC7351_B]
R14  3.3K / 0.1W / 1% / SMD 0603  LDL_NUMBER: LRE140  [LFP020__CR1608-0603-IPC7351_B]
TP24  SMD_TP  [SMD-TP]  (no BOM)

### Ports
BRAKE_MLP (out), MA420IN (in)

### Nets
AGND: C21.2 C22.2 C23.2 IC11.2(CT) IC11.4(V-) IC11.5(REFCOM) IC11.13(RCV_COM) IC12.1(A) R14.1
P24VA: C22.1 C23.1 IC11.16(V+)
BRAKE_MLP: C21.1 IC12.3(K) R13.1 R14.2 TP24.1 ; port BRAKE_MLP
MA420IN: IC11.3(IN_P) ; port MA420IN
NetIC11_11: IC11.11(REF_OUT) IC11.12(REF_IN)
NetIC11_14: IC11.14(OUT) IC11.15(RCV_Fb) R13.2

Not connected (* = marked no-connect by the designer): IC11 1(IN_N) 7(REFNOISE) 8(REFTRIM) 10(REF_Fb)

### Channels
U_LPCB220 - MLP INTERFACE/BL1: designators end in _BL1; ports BRAKE_MLP=BRAKE_MLP1 MA420IN=BL_MA420IN1
U_LPCB220 - MLP INTERFACE/BL2: designators end in _BL2; ports BRAKE_MLP=BRAKE_MLP2 MA420IN=BL_MA420IN2

### Notes on the sheet
- PCB COMPONENT DESCRIPTION
- LDL NUMBER
- Assembly Details
- Size
- Drawing File Name
- Revision
- http://rloop.org
- Scale
- A3
- Sheet Details
- N.T.S
- Sheet:
- Of:

### Library data of the parts
C21 = 10pF / 50V / 5% / SMD 0603: Capacitor, Ceramic Chip, 10pF, 50V, 5%, SMD 0603 [LCA019]; Value: 10p; FMEDA__OPERATING__VOLTAGE_MAX: 3.3; FMEDA__OPERATING__VOLTAGE_MIN: 0; FMEDA__OPERATING__TEMP_MAX: 50; FMEDA__OPERATING__TEMP_MIN: -20; FMEDA__OPERATING__TEMP_TYP: 27; FMEDA__CHANNEL: COM; FMEDA__OPERATING__VOLTAGE_TYP: 3.3; FMEDA__FUNCTION_IN_SYSTEM: *
C22 = 100n / 50V / 10% / SMD 0603: as C2 on sheet LPCB220 - BRAKE FAILSAFE; Value: 100n; FMEDA__FUNCTION_IN_SYSTEM: *; FMEDA__OPERATING__VOLTAGE_TYP: 3.3
C23 = 1uF / 50V / 10% / SMD 0805: Capacitor, Ceramic Chip, 1uF, 50V, SMD 0805 [LCA098]; Value: 1u; FMEDA__OPERATING__VOLTAGE_MAX: 3.3; FMEDA__OPERATING__VOLTAGE_MIN: 0; FMEDA__OPERATING__TEMP_MAX: 50; FMEDA__OPERATING__TEMP_MIN: -20; FMEDA__OPERATING__TEMP_TYP: 27; FMEDA__CHANNEL: COM; FMEDA__OPERATING__VOLTAGE_TYP: 3.3; FMEDA__FUNCTION_IN_SYSTEM: *
IC11 = RCV420JP: IC, 4-20mA Interface, DIP16 [LIC546]
IC12 = BZX84C3V6LT1G: Diode, Zener, 3.6V, 0.225W, SMD [LIC083]; FMEDA__OPERATING__TEMP_MAX: 50; FMEDA__OPERATING__TEMP_MIN: -20; FMEDA__OPERATING__TEMP_TYP: 27; FMEDA__OPERATING__VOLTAGE_MAX: 0; FMEDA__CHANNEL: COM; Revision: 17-Jul-2002: Re-released for DXP Platform.; FMEDA__FUNCTION_IN_SYSTEM: *; FMEDA__OPERATING__VOLTAGE_MIN: 0; FMEDA__OPERATING__VOLTAGE_TYP: 0; FMEDA__OPERATING__CURRENT_MAX: 0; FMEDA__OPERATING__CURRENT_MIN: 0; FMEDA__OPERATING__CURRENT_TYP: 0
R13 = 1.78K / 0.1W / 1% / 50V / SMD 0603: Resistor, Ceramic Chip, 1.78K, 0.1W, 1%, SMD 0603 [LRE167]; FMEDA__OPERATING__POWER_MAX: 0.01; FMEDA__OPERATING__POWER_MIN: 0; FMEDA__OPERATING__TEMP_MAX: 50; FMEDA__OPERATING__TEMP_MIN: -20; FMEDA__OPERATING__TEMP_TYP: 27; FMEDA__CHANNEL: COM; Value: 1.78K; FMEDA__OPERATING__VOLTAGE_MAX: 0; FMEDA__OPERATING__VOLTAGE_MIN: 0; FMEDA__OPERATING__VOLTAGE_TYP: 0; FMEDA__FUNCTION_IN_SYSTEM: *
R14 = 3.3K / 0.1W / 1% / SMD 0603: Resistor, Ceramic Chip, 3.3K0, 0.1W, 1%, SMD 0603 [LRE140]; FMEDA__OPERATING__POWER_MAX: 0; FMEDA__OPERATING__TEMP_MAX: 50; FMEDA__OPERATING__TEMP_MIN: -20; FMEDA__OPERATING__TEMP_TYP: 27; FMEDA__CHANNEL: COM; Value: 3.3K; FMEDA__OPERATING__POWER_MIN: 0; FMEDA__OPERATING__VOLTAGE_MAX: 0; FMEDA__OPERATING__VOLTAGE_MIN: 0; FMEDA__OPERATING__VOLTAGE_TYP: 0; FMEDA__FUNCTION_IN_SYSTEM: *
TP24 = SMD_TP: as TP25 on sheet LPCB220 - BRAKE FAILSAFE; FMEDA__OPERATING__CURRENT_MIN: 0; FMEDA__OPERATING__CURRENT_TYP: 0; FMEDA__OPERATING__VOLTAGE_MIN: 0

## Sheet LPCB220 - PUSHER INTERLOCK.SchDoc
size A3; Address1: Factory 10; Address2: 9-13 Dingley Avenue, Dandeong, VICTORIA 3175, AUSTRALIA; DocumentNumber: 13; Revision: 1; SheetNumber: 13; SheetTotal: 18; Lockie__PCB_SUB_ASSEMBLY: Pusher Interlock System; Lockie__PCB_ASSEMBLY: Brake Control; Lockie__LDL: LPCB220; Lockie__PCB_DESCRIPTION: Redundant Stepper Node
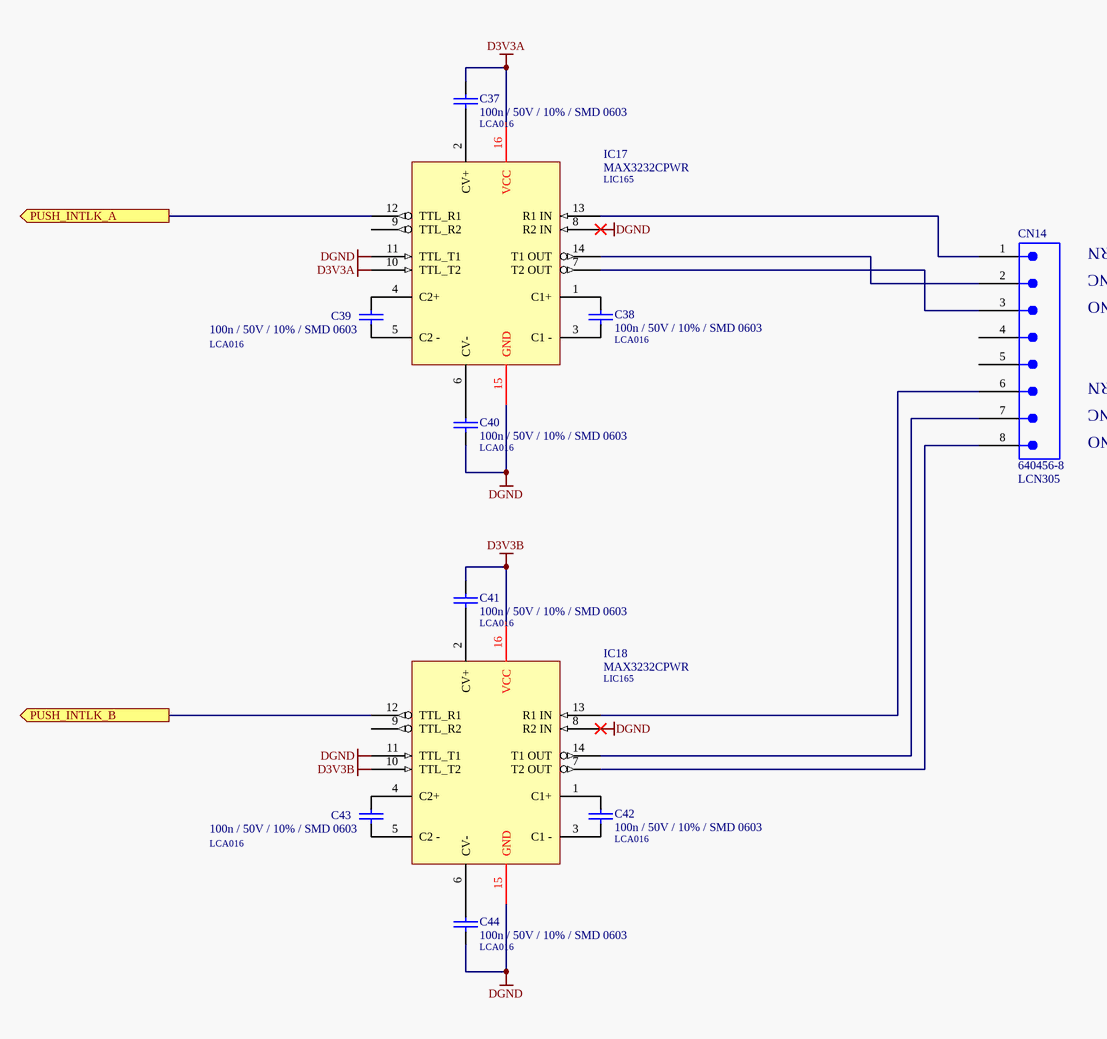
[diagram p5: LPCB220 - PUSHER INTERLOCK.SchDoc]

### Parts
C37  100n / 50V / 10% / SMD 0603  LDL_NUMBER: LCA016  [LFP011__CC1608-0603-IPC7351_B]
C38  100n / 50V / 10% / SMD 0603  LDL_NUMBER: LCA016  [LFP011__CC1608-0603-IPC7351_B]
C39  100n / 50V / 10% / SMD 0603  LDL_NUMBER: LCA016  [LFP011__CC1608-0603-IPC7351_B]
C40  100n / 50V / 10% / SMD 0603  LDL_NUMBER: LCA016  [LFP011__CC1608-0603-IPC7351_B]
C41  100n / 50V / 10% / SMD 0603  LDL_NUMBER: LCA016  [LFP011__CC1608-0603-IPC7351_B]
C42  100n / 50V / 10% / SMD 0603  LDL_NUMBER: LCA016  [LFP011__CC1608-0603-IPC7351_B]
C43  100n / 50V / 10% / SMD 0603  LDL_NUMBER: LCA016  [LFP011__CC1608-0603-IPC7351_B]
C44  100n / 50V / 10% / SMD 0603  LDL_NUMBER: LCA016  [LFP011__CC1608-0603-IPC7351_B]
CN14  640456-8  LDL_NUMBER: LCN305  [640456-8]
IC17  MAX3232CPWR  LDL_NUMBER: LIC165  [LFP049__TSSOP-16]
IC18  MAX3232CPWR  LDL_NUMBER: LIC165  [LFP049__TSSOP-16]

### Ports
PUSH_INTLK_A (out), PUSH_INTLK_B (out)

### Nets
D3V3A: C37.1 IC17.10(TTL_T2) IC17.16(VCC)
D3V3B: C41.1 IC18.10(TTL_T2) IC18.16(VCC)
DGND: C40.2 C44.2 IC17.8(R2_IN) IC17.11(TTL_T1) IC17.15(GND) IC18.8(R2_IN) IC18.11(TTL_T1) IC18.15(GND)
PUSH_INTLK_A: IC17.12(TTL_R1) ; port PUSH_INTLK_A
PUSH_INTLK_B: IC18.12(TTL_R1) ; port PUSH_INTLK_B
NetC37_2: C37.2 IC17.2(CV+)
NetC38_1: C38.1 IC17.1(C1+)
NetC38_2: C38.2 IC17.3(C1_-)
NetC39_1: C39.1 IC17.4(C2+)
NetC39_2: C39.2 IC17.5(C2_-)
NetC40_1: C40.1 IC17.6(CV-)
NetC41_2: C41.2 IC18.2(CV+)
NetC42_1: C42.1 IC18.1(C1+)
NetC42_2: C42.2 IC18.3(C1_-)
NetC43_1: C43.1 IC18.4(C2+)
NetC43_2: C43.2 IC18.5(C2_-)
NetC44_1: C44.1 IC18.6(CV-)
NetCN14_1: CN14.1 IC17.13(R1_IN)
NetCN14_2: CN14.2 IC17.14(T1_OUT)
NetCN14_3: CN14.3 IC17.7(T2_OUT)
NetCN14_6: CN14.6 IC18.13(R1_IN)
NetCN14_7: CN14.7 IC18.14(T1_OUT)
NetCN14_8: CN14.8 IC18.7(T2_OUT)

Not connected (* = marked no-connect by the designer): CN14 4 5; IC17 9(TTL_R2); IC18 9(TTL_R2)

### Notes on the sheet
- SW RETURN
- SW NO
- SW NC
- PCB COMPONENT DESCRIPTION
- LDL NUMBER
- Assembly Details
- Size
- Drawing File Name
- Revision
- http://rloop.org
- Scale
- A3
- Sheet Details
- N.T.S
- Sheet:
- Of:

### Library data of the parts
C37-C44 = 100n / 50V / 10% / SMD 0603: Capacitor, Ceramic Chip, 100nF, 50V, 10%, SMD 0603; FMEDA__OPERATING__VOLTAGE_MIN: 0; FMEDA__OPERATING__VOLTAGE_MAX: 3.3; FMEDA__OPERATING__TEMP_MIN: -20; FMEDA__OPERATING__TEMP_TYP: 27; FMEDA__OPERATING__TEMP_MAX: 50; FMEDA__CHANNEL: COM; Value: 100n; FMEDA__FUNCTION_IN_SYSTEM: *; FMEDA__OPERATING__VOLTAGE_TYP: 3.3
CN14 = 640456-8: as CN7 on sheet LPCB220 - BRAKE FAILSAFE; FMEDA__FUNCTION_IN_SYSTEM: *; FMEDA__OPERATING__CURRENT_MIN: 0; FMEDA__OPERATING__CURRENT_TYP: 0; FMEDA__OPERATING__VOLTAGE_MIN: 0
IC17 IC18 = MAX3232CPWR: IC, RS232 Line Driver, 3.3V, SMD TSSOP16; FMEDA__OPERATING__TEMP_MAX: 50; FMEDA__OPERATING__TEMP_MIN: -20; FMEDA__OPERATING__TEMP_TYP: 27; FMEDA__CHANNEL: COM; FMEDA__OPERATING__VOLTAGE_MAX: 3.3; FMEDA__OPERATING__VOLTAGE_MIN: 0; FMEDA__FUNCTION_IN_SYSTEM: *; FMEDA__OPERATING__VOLTAGE_TYP: 3.3

## Sheet LPCB220 - AUXPROP INTERFACE.SchDoc
size A3; Address1: Factory 10; Address2: 9-13 Dingley Avenue, Dandeong, VICTORIA 3175, AUSTRALIA; DocumentNumber: 2; Revision: 1; SheetNumber: 2; SheetTotal: 18; Lockie__PCB_SUB_ASSEMBLY: Aux Prop Interface; Lockie__PCB_ASSEMBLY: Brake Control; Lockie__LDL: LPCB220; Lockie__PCB_DESCRIPTION: Redundant Stepper Node
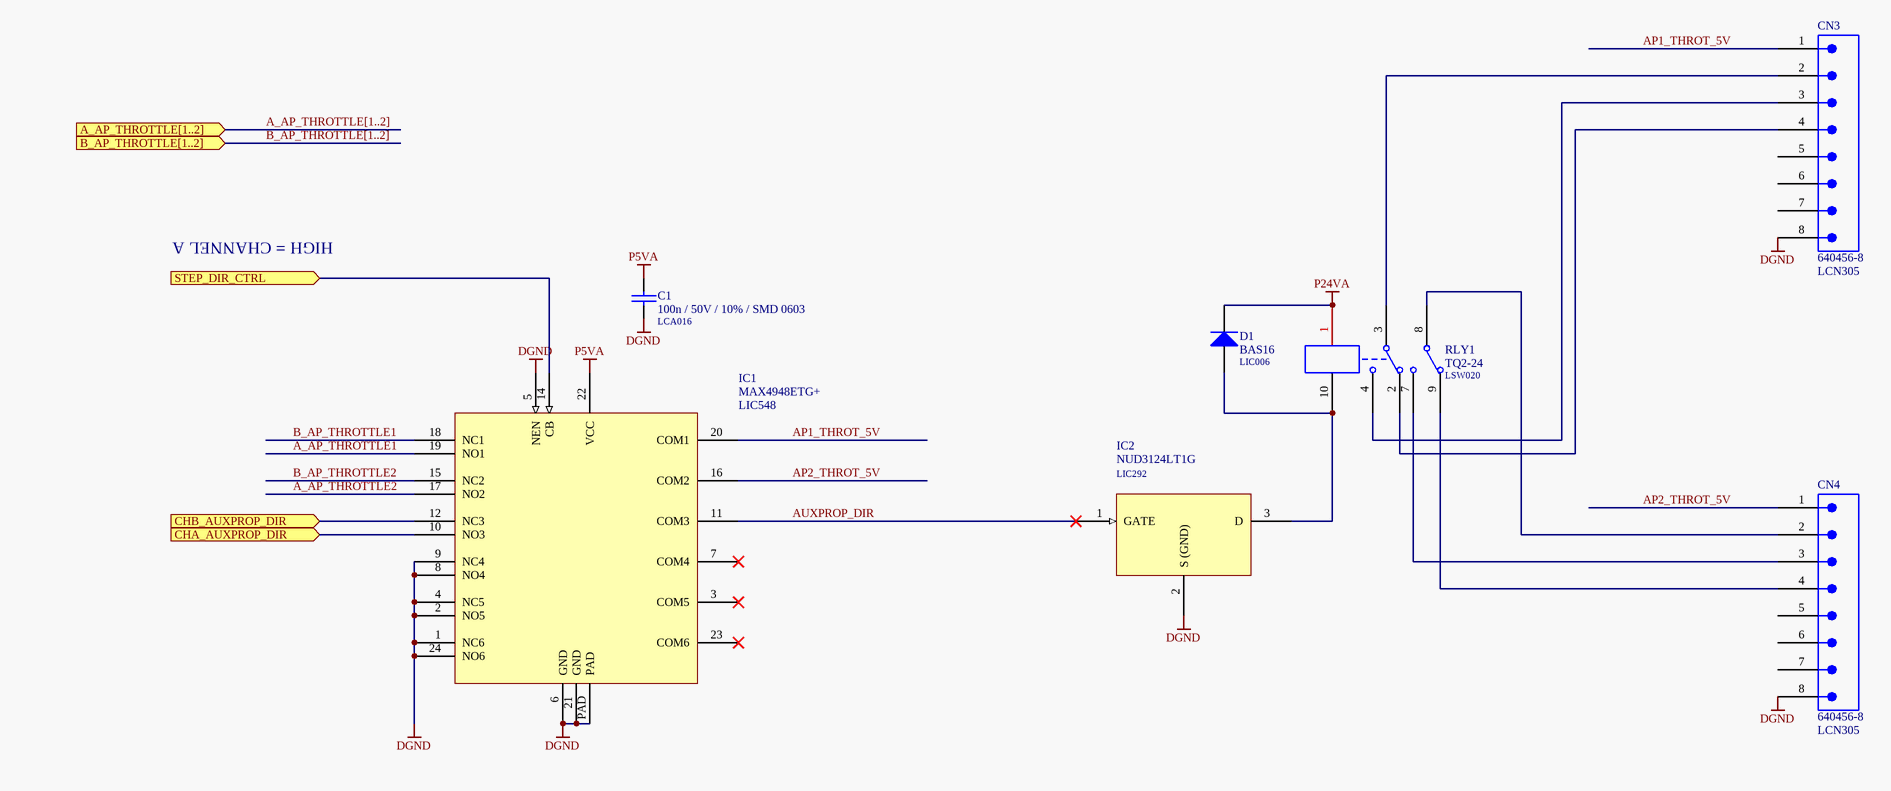
[diagram p6: LPCB220 - AUXPROP INTERFACE.SchDoc]

### Parts
C1  100n / 50V / 10% / SMD 0603  LDL_NUMBER: LCA016  [LFP011__CC1608-0603-IPC7351_B]
CN3  640456-8  LDL_NUMBER: LCN305  [640456-8]
CN4  640456-8  LDL_NUMBER: LCN305  [640456-8]
D1  BAS16  LDL_NUMBER: LIC006  [LFP021__SOT23]
IC1  MAX4948ETG+  LDL_NUMBER: LIC548  [LFP095__QFN127P600-8N]
IC2  NUD3124LT1G  LDL_NUMBER: LIC292  [LFP021__SOT23]
RLY1  TQ2-24  LDL_NUMBER: LSW020  [TQ2]

### Ports
A_AP_THROTTLE[1..2] (in), B_AP_THROTTLE[1..2] (in), CHA_AUXPROP_DIR (in), CHB_AUXPROP_DIR (in), STEP_DIR_CTRL (in)

### Nets
DGND: C1.2 CN3.8 CN4.8 IC1.1(NC6) IC1.2(NO5) IC1.4(NC5) IC1.5(NEN) IC1.6(GND) IC1.8(NO4) IC1.9(NC4) IC1.21(GND) IC1.24(NO6) IC1.PAD IC2.2(S_(GND))
P5VA: C1.1 IC1.22(VCC)
P24VA: D1.3(K) RLY1.1
A_AP_THROTTLE1: IC1.19(NO1)
A_AP_THROTTLE2: IC1.17(NO2)
AP1_THROT_5V: CN3.1 IC1.20(COM1)
AP2_THROT_5V: CN4.1 IC1.16(COM2)
AUXPROP_DIR: IC1.11(COM3) IC2.1(GATE)
B_AP_THROTTLE1: IC1.18(NC1)
B_AP_THROTTLE2: IC1.15(NC2)
CHA_AUXPROP_DIR: IC1.10(NO3) ; port CHA_AUXPROP_DIR
CHB_AUXPROP_DIR: IC1.12(NC3) ; port CHB_AUXPROP_DIR
STEP_DIR_CTRL: IC1.14(CB) ; port STEP_DIR_CTRL
NetCN3_2: CN3.2 RLY1.3
NetCN3_3: CN3.3 RLY1.4
NetCN3_4: CN3.4 RLY1.2
NetCN4_2: CN4.2 RLY1.8
NetCN4_3: CN4.3 RLY1.7
NetCN4_4: CN4.4 RLY1.9
NetD1_1: D1.1(A) IC2.3(D) RLY1.10

Not connected (* = marked no-connect by the designer): CN3 5 6 7; CN4 5 6 7; IC1 3(COM5)* 7(COM4)* 23(COM6)*

### Buses and harness runs
bus A_AP_THROTTLE[1..2] = port A_AP_THROTTLE[1..2]
bus B_AP_THROTTLE[1..2] = port B_AP_THROTTLE[1..2]

### Notes on the sheet
- HIGH = CHANNEL A
- PCB COMPONENT DESCRIPTION
- LDL NUMBER
- Assembly Details
- Size
- Drawing File Name
- Revision
- http://rloop.org
- Scale
- A3
- Sheet Details
- N.T.S
- Sheet:
- Of:

### Library data of the parts
C1 = 100n / 50V / 10% / SMD 0603: as C2 on sheet LPCB220 - BRAKE FAILSAFE; Value: 100n; FMEDA__FUNCTION_IN_SYSTEM: *; FMEDA__OPERATING__VOLTAGE_TYP: 3.3
CN3 CN4 = 640456-8: as CN7 on sheet LPCB220 - BRAKE FAILSAFE; FMEDA__FUNCTION_IN_SYSTEM: *; FMEDA__OPERATING__CURRENT_MIN: 0; FMEDA__OPERATING__CURRENT_TYP: 0; FMEDA__OPERATING__VOLTAGE_MIN: 0
D1 = BAS16: as D2 on sheet LPCB220 - BRAKE FAILSAFE; FMEDA__OPERATING__CURRENT_MAX: 0; FMEDA__OPERATING__VOLTAGE_MIN: 0; FMEDA__OPERATING__VOLTAGE_MAX: 0; FMEDA__FUNCTION_IN_SYSTEM: *; FMEDA__OPERATING__CURRENT_TYP: 0; FMEDA__OPERATING__VOLTAGE_TYP: 0
IC1 = MAX4948ETG+: IC, Analog Switch, SMD [LIC548]
IC2 = NUD3124LT1G: as IC6 on sheet LPCB220 - BRAKE FAILSAFE; FMEDA__FUNCTION_IN_SYSTEM: *; FMEDA__OPERATING__POWER_MIN: 0
RLY1 = TQ2-24: as RLY2 on sheet LPCB220 - BRAKE FAILSAFE; Revision: July-2002: Re-released for DXP Platform.

## Sheet LPCB220 - DAC A.SchDoc
size A3; Address1: Factory 10; Address2: 9-13 Dingley Avenue, Dandeong, VICTORIA 3175, AUSTRALIA; DocumentNumber: 6; Revision: 1; SheetNumber: 6; SheetTotal: 18; Lockie__PCB_SUB_ASSEMBLY: DAC A; Lockie__PCB_ASSEMBLY: Brake Control; Lockie__LDL: LPCB220; Lockie__PCB_DESCRIPTION: Redundant Stepper Node
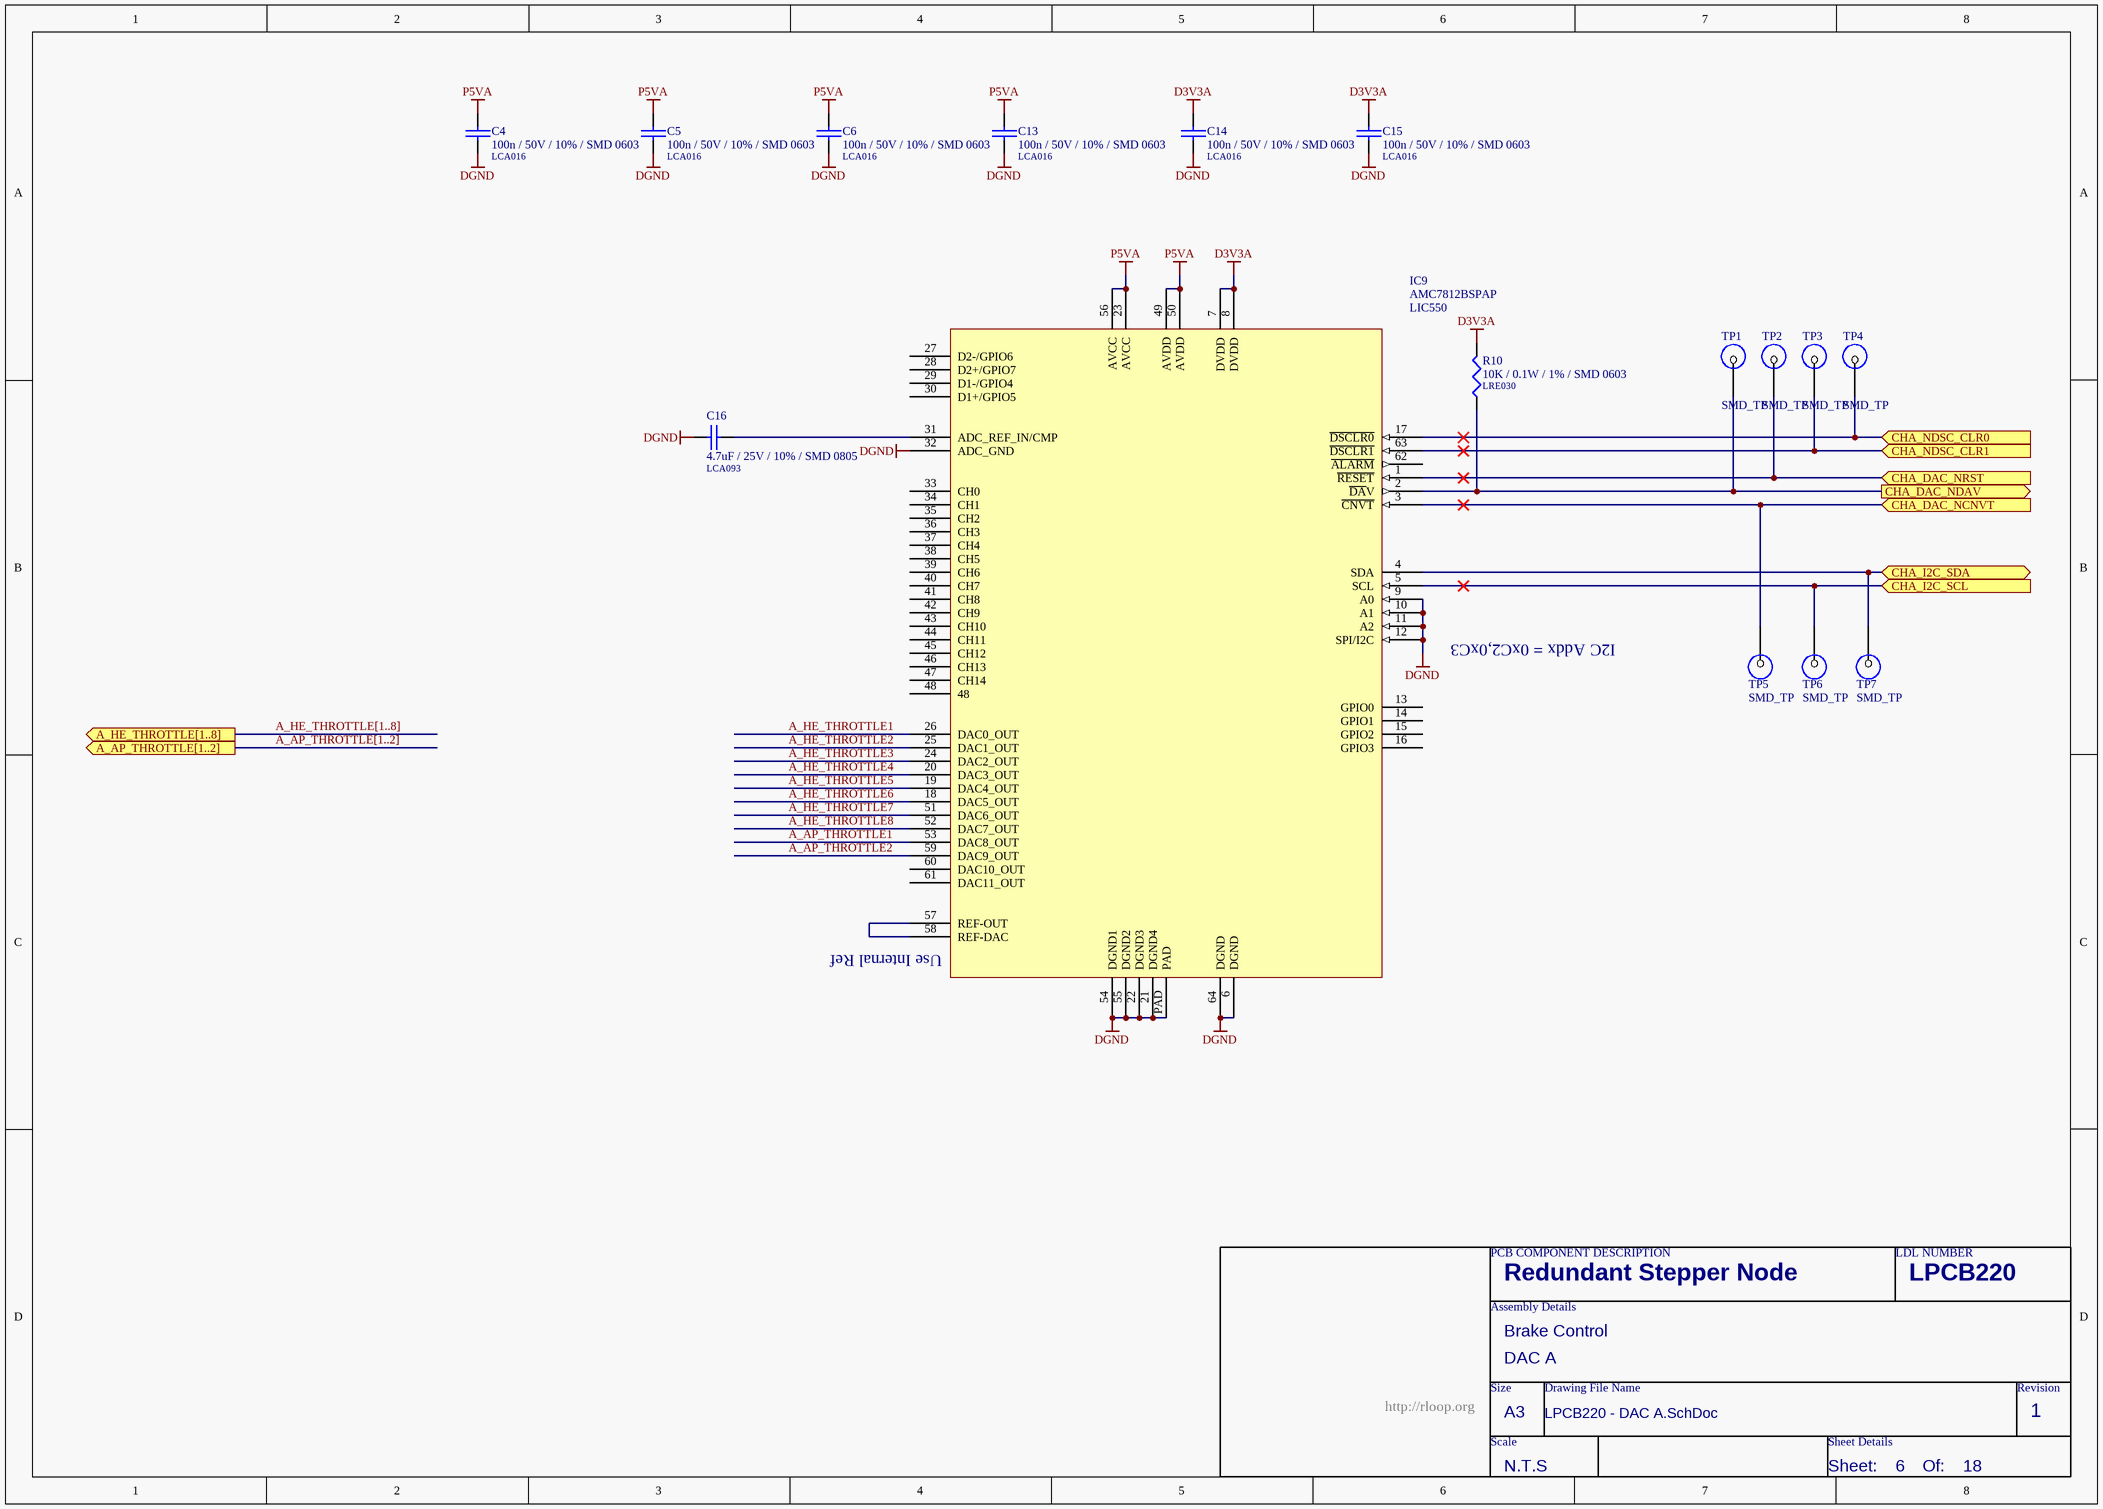
[diagram p7: LPCB220 - DAC A.SchDoc]

### Parts
C4  100n / 50V / 10% / SMD 0603  LDL_NUMBER: LCA016  [LFP011__CC1608-0603-IPC7351_B]
C5  100n / 50V / 10% / SMD 0603  LDL_NUMBER: LCA016  [LFP011__CC1608-0603-IPC7351_B]
C6  100n / 50V / 10% / SMD 0603  LDL_NUMBER: LCA016  [LFP011__CC1608-0603-IPC7351_B]
C13  100n / 50V / 10% / SMD 0603  LDL_NUMBER: LCA016  [LFP011__CC1608-0603-IPC7351_B]
C14  100n / 50V / 10% / SMD 0603  LDL_NUMBER: LCA016  [LFP011__CC1608-0603-IPC7351_B]
C15  100n / 50V / 10% / SMD 0603  LDL_NUMBER: LCA016  [LFP011__CC1608-0603-IPC7351_B]
C16  4.7uF / 25V / 10% / SMD 0805  LDL_NUMBER: LCA093  [LFP010__CC2012-0805-IPC7351_B]
IC9  AMC7812BSPAP  LDL_NUMBER: LIC550  [LFP134__H-QFP10X10-64N]
R10  10K / 0.1W / 1% / SMD 0603  LDL_NUMBER: LRE030  [LFP020__CR1608-0603-IPC7351_B]
TP1  SMD_TP  [SMD-TP]  (no BOM)
TP2  SMD_TP  [SMD-TP]  (no BOM)
TP3  SMD_TP  [SMD-TP]  (no BOM)
TP4  SMD_TP  [SMD-TP]  (no BOM)
TP5  SMD_TP  [SMD-TP]  (no BOM)
TP6  SMD_TP  [SMD-TP]  (no BOM)
TP7  SMD_TP  [SMD-TP]  (no BOM)

### Ports
A_AP_THROTTLE[1..2] (out), A_HE_THROTTLE[1..8] (out), CHA_DAC_NCNVT (in), CHA_DAC_NDAV (out), CHA_DAC_NRST (in), CHA_I2C_SCL (in), CHA_I2C_SDA (bidir), CHA_NDSC_CLR0 (in), CHA_NDSC_CLR1 (in)

### Nets
D3V3A: C14.1 C15.1 IC9.7(DVDD) IC9.8(DVDD) R10.2
DGND: C4.2 C5.2 C6.2 C13.2 C14.2 C15.2 C16.1 IC9.6(DGND) IC9.9(A0) IC9.10(A1) IC9.11(A2) IC9.12(SPI/I2C) IC9.21(DGND4) IC9.22(DGND3) IC9.32(ADC_GND) IC9.54(DGND1) IC9.55(DGND2) IC9.64(DGND) IC9.PAD
P5VA: C4.1 C5.1 C6.1 C13.1 IC9.23(AVCC) IC9.49(AVDD) IC9.50(AVDD) IC9.56(AVCC)
A_AP_THROTTLE1: IC9.53(DAC8_OUT)
A_AP_THROTTLE2: IC9.59(DAC9_OUT)
A_HE_THROTTLE1: IC9.26(DAC0_OUT)
A_HE_THROTTLE2: IC9.25(DAC1_OUT)
A_HE_THROTTLE3: IC9.24(DAC2_OUT)
A_HE_THROTTLE4: IC9.20(DAC3_OUT)
A_HE_THROTTLE5: IC9.19(DAC4_OUT)
A_HE_THROTTLE6: IC9.18(DAC5_OUT)
A_HE_THROTTLE7: IC9.51(DAC6_OUT)
A_HE_THROTTLE8: IC9.52(DAC7_OUT)
CHA_DAC_NCNVT: IC9.3(~{CNVT}) TP5.1 ; port CHA_DAC_NCNVT
CHA_DAC_NDAV: IC9.2(~{DA}V) R10.1 TP1.1 ; port CHA_DAC_NDAV
CHA_DAC_NRST: IC9.1(~{RESET}) TP2.1 ; port CHA_DAC_NRST
CHA_I2C_SCL: IC9.5(SCL) TP6.1 ; port CHA_I2C_SCL
CHA_I2C_SDA: IC9.4(SDA) TP7.1 ; port CHA_I2C_SDA
CHA_NDSC_CLR0: IC9.17(~{DSCLR0}) TP4.1 ; port CHA_NDSC_CLR0
CHA_NDSC_CLR1: IC9.63(~{DSCLR1}) TP3.1 ; port CHA_NDSC_CLR1
NetC16_2: C16.2 IC9.31(ADC_REF_IN/CMP)
NetIC9_57: IC9.57(REF-OUT) IC9.58(REF-DAC)

Not connected (* = marked no-connect by the designer): IC9 13(GPIO0) 14(GPIO1) 15(GPIO2) 16(GPIO3) 27(D2-/GPIO6) 28(D2+/GPIO7) 29(D1-/GPIO4) 30(D1+/GPIO5) 33(CH0) 34(CH1) 35(CH2) 36(CH3) 37(CH4) 38(CH5) 39(CH6) 40(CH7) 41(CH8) 42(CH9) 43(CH10) 44(CH11) 45(CH12) 46(CH13) 47(CH14) 48 60(DAC10_OUT) 61(DAC11_OUT) 62(~{ALARM})

### Buses and harness runs
bus A_AP_THROTTLE[1..2] = port A_AP_THROTTLE[1..2]
bus A_HE_THROTTLE[1..8] = port A_HE_THROTTLE[1..8]

### Notes on the sheet
- I2C Addx = 0xC2,0xC3
- (near IC9) Use Internal Ref
- PCB COMPONENT DESCRIPTION
- LDL NUMBER
- Assembly Details
- Size
- Drawing File Name
- Revision
- http://rloop.org
- Scale
- A3
- Sheet Details
- N.T.S
- Sheet:
- Of:

### Library data of the parts
C4-C6 C13-C15 = 100n / 50V / 10% / SMD 0603: as C2 on sheet LPCB220 - BRAKE FAILSAFE; Value: 100n; FMEDA__FUNCTION_IN_SYSTEM: *; FMEDA__OPERATING__VOLTAGE_TYP: 3.3
C16 = 4.7uF / 25V / 10% / SMD 0805: Capacitor, Ceramic Chip, 4.7uF, 25V, 10%, SMD 0805 [LCA093]; Value: 4.7u; FMEDA__OPERATING__TEMP_MAX: 50; FMEDA__OPERATING__TEMP_MIN: -20; FMEDA__OPERATING__TEMP_TYP: 27; FMEDA__OPERATING__VOLTAGE_MAX: 0; FMEDA__CHANNEL: COM; FMEDA__OPERATING__VOLTAGE_MIN: 0; FMEDA__OPERATING__VOLTAGE_TYP: 0; FMEDA__FUNCTION_IN_SYSTEM: *
IC9 = AMC7812BSPAP: IC, ADC / DAC, SMD [LIC550]
R10 = 10K / 0.1W / 1% / SMD 0603: as R21 on sheet LPCB220 - WATCHDOG; Value: 10K; FMEDA__OPERATING__POWER_MIN: 0; FMEDA__OPERATING__VOLTAGE_MAX: 0; FMEDA__OPERATING__VOLTAGE_MIN: 0; FMEDA__OPERATING__VOLTAGE_TYP: 0; FMEDA__FUNCTION_IN_SYSTEM: *
TP1-TP7 = SMD_TP: as TP25 on sheet LPCB220 - BRAKE FAILSAFE; FMEDA__OPERATING__CURRENT_MIN: 0; FMEDA__OPERATING__CURRENT_TYP: 0; FMEDA__OPERATING__VOLTAGE_MIN: 0

## Sheet LPCB220 - DAC B.SchDoc
size A3; Address1: Factory 10; Address2: 9-13 Dingley Avenue, Dandeong, VICTORIA 3175, AUSTRALIA; DocumentNumber: 7; Revision: 1; SheetNumber: 7; SheetTotal: 18; Lockie__PCB_SUB_ASSEMBLY: DAC B; Lockie__PCB_ASSEMBLY: Brake Control; Lockie__LDL: LPCB220; Lockie__PCB_DESCRIPTION: Redundant Stepper Node
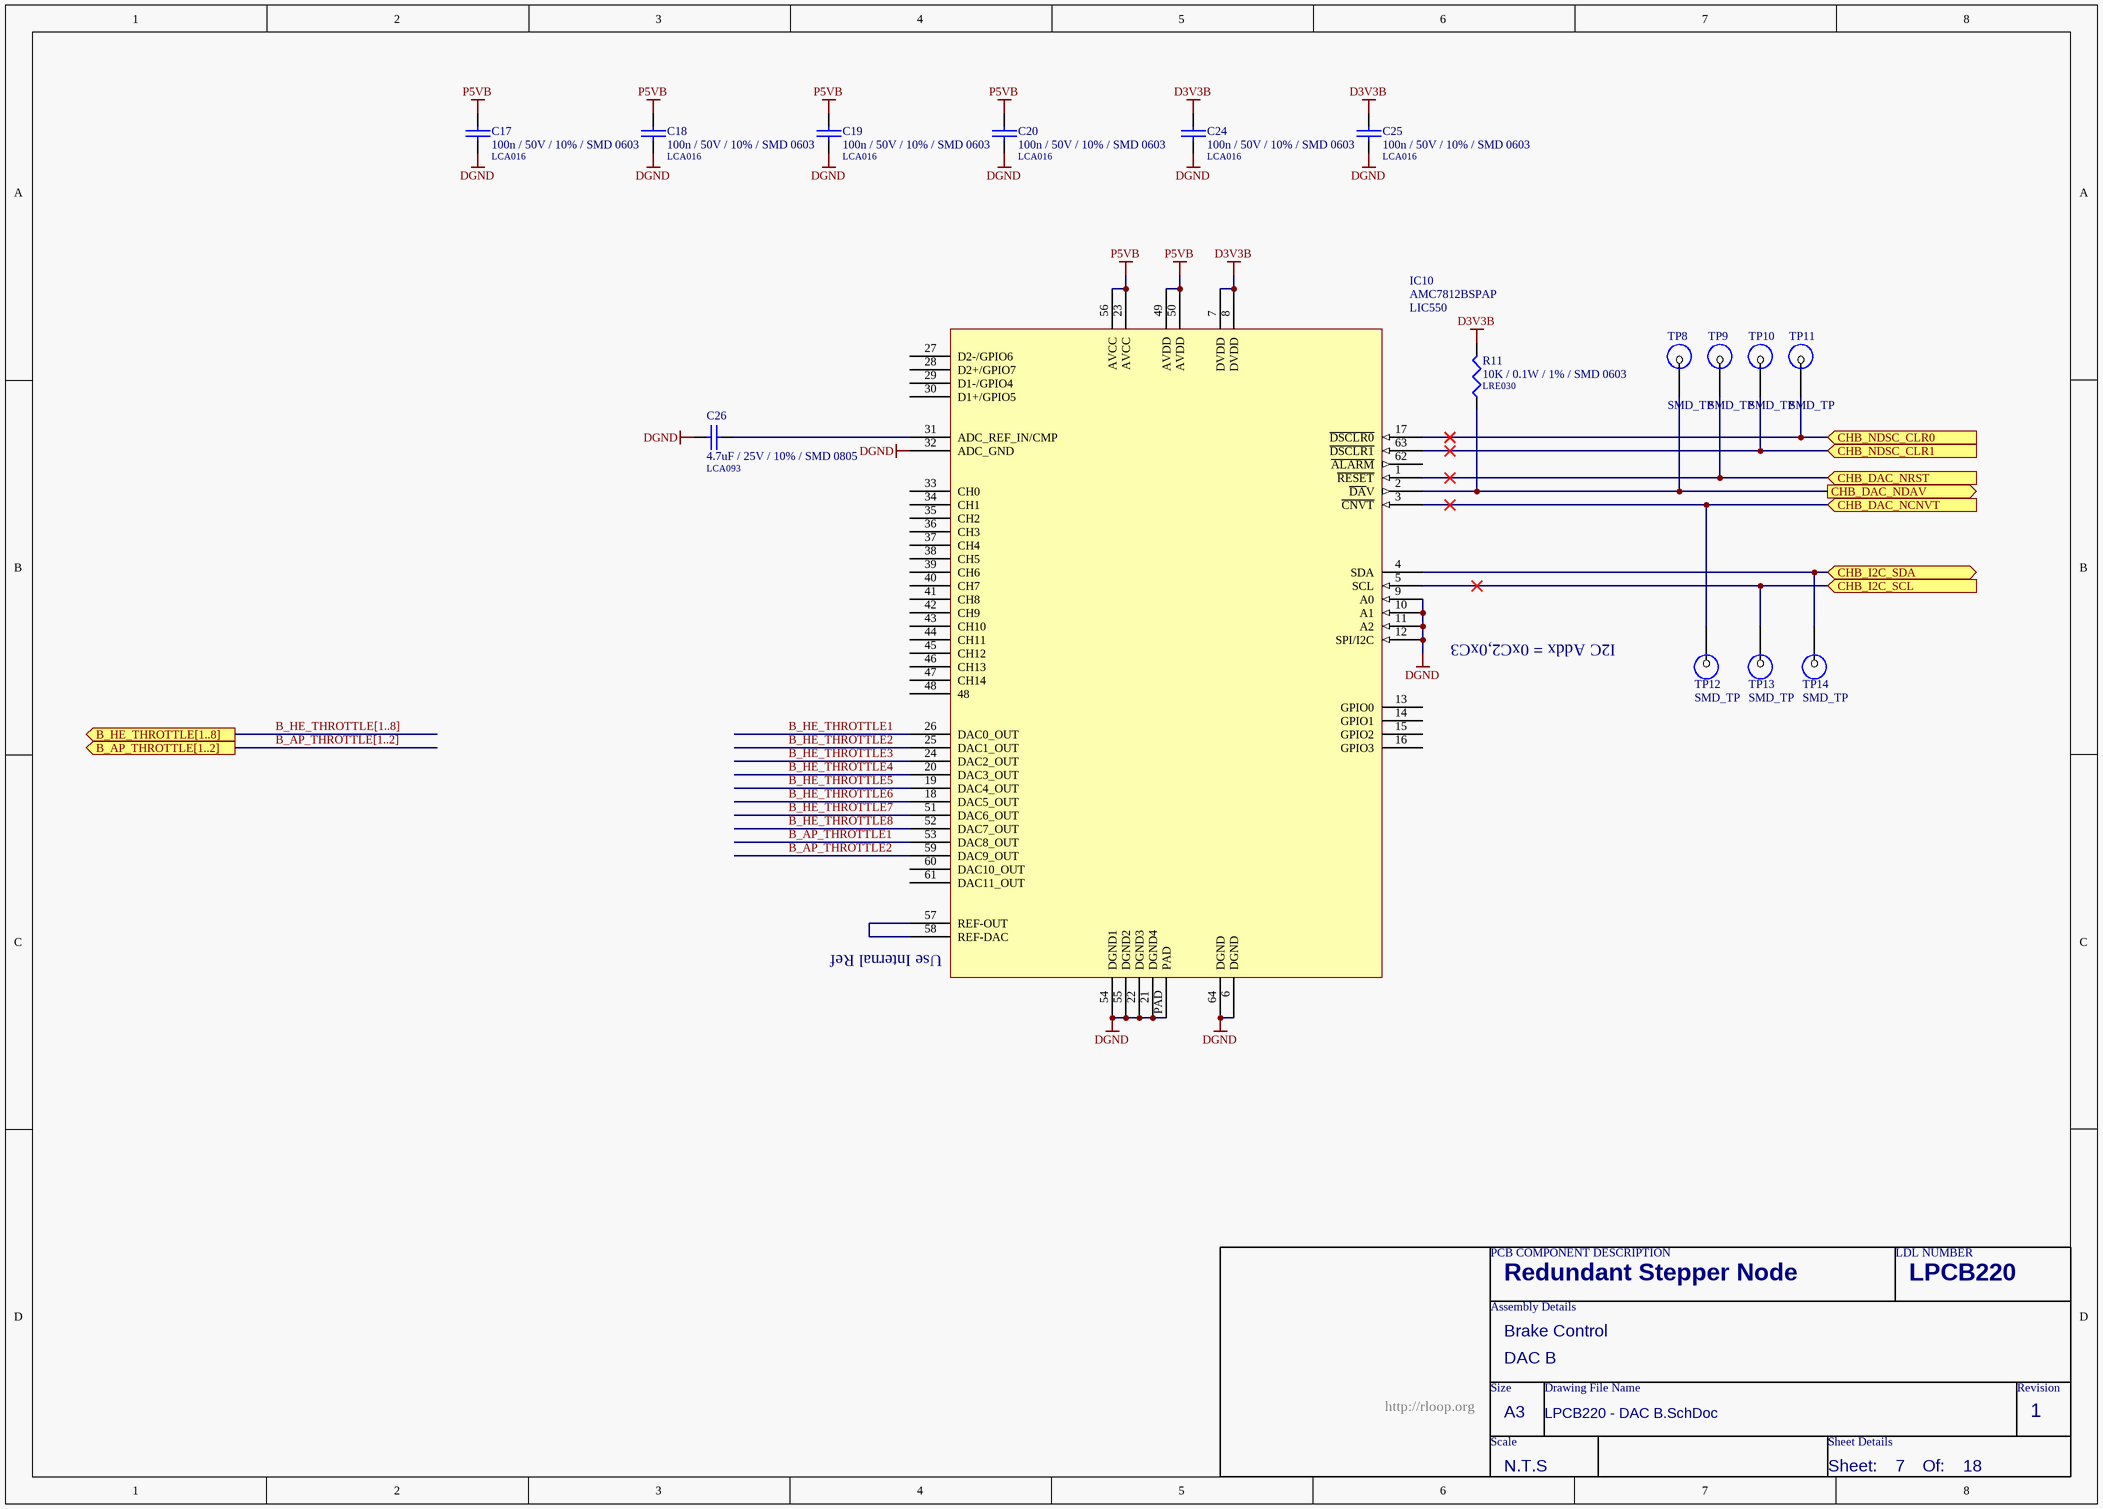
[diagram p8: LPCB220 - DAC B.SchDoc]

### Parts
C17  100n / 50V / 10% / SMD 0603  LDL_NUMBER: LCA016  [LFP011__CC1608-0603-IPC7351_B]
C18  100n / 50V / 10% / SMD 0603  LDL_NUMBER: LCA016  [LFP011__CC1608-0603-IPC7351_B]
C19  100n / 50V / 10% / SMD 0603  LDL_NUMBER: LCA016  [LFP011__CC1608-0603-IPC7351_B]
C20  100n / 50V / 10% / SMD 0603  LDL_NUMBER: LCA016  [LFP011__CC1608-0603-IPC7351_B]
C24  100n / 50V / 10% / SMD 0603  LDL_NUMBER: LCA016  [LFP011__CC1608-0603-IPC7351_B]
C25  100n / 50V / 10% / SMD 0603  LDL_NUMBER: LCA016  [LFP011__CC1608-0603-IPC7351_B]
C26  4.7uF / 25V / 10% / SMD 0805  LDL_NUMBER: LCA093  [LFP010__CC2012-0805-IPC7351_B]
IC10  AMC7812BSPAP  LDL_NUMBER: LIC550  [LFP134__H-QFP10X10-64N]
R11  10K / 0.1W / 1% / SMD 0603  LDL_NUMBER: LRE030  [LFP020__CR1608-0603-IPC7351_B]
TP8  SMD_TP  [SMD-TP]  (no BOM)
TP9  SMD_TP  [SMD-TP]  (no BOM)
TP10  SMD_TP  [SMD-TP]  (no BOM)
TP11  SMD_TP  [SMD-TP]  (no BOM)
TP12  SMD_TP  [SMD-TP]  (no BOM)
TP13  SMD_TP  [SMD-TP]  (no BOM)
TP14  SMD_TP  [SMD-TP]  (no BOM)

### Ports
B_AP_THROTTLE[1..2] (out), B_HE_THROTTLE[1..8] (out), CHB_DAC_NCNVT (in), CHB_DAC_NDAV (out), CHB_DAC_NRST (in), CHB_I2C_SCL (in), CHB_I2C_SDA (bidir), CHB_NDSC_CLR0 (in), CHB_NDSC_CLR1 (in)

### Nets
D3V3B: C24.1 C25.1 IC10.7(DVDD) IC10.8(DVDD) R11.2
DGND: C17.2 C18.2 C19.2 C20.2 C24.2 C25.2 C26.1 IC10.6(DGND) IC10.9(A0) IC10.10(A1) IC10.11(A2) IC10.12(SPI/I2C) IC10.21(DGND4) IC10.22(DGND3) IC10.32(ADC_GND) IC10.54(DGND1) IC10.55(DGND2) IC10.64(DGND) IC10.PAD
P5VB: C17.1 C18.1 C19.1 C20.1 IC10.23(AVCC) IC10.49(AVDD) IC10.50(AVDD) IC10.56(AVCC)
B_AP_THROTTLE1: IC10.53(DAC8_OUT)
B_AP_THROTTLE2: IC10.59(DAC9_OUT)
B_HE_THROTTLE1: IC10.26(DAC0_OUT)
B_HE_THROTTLE2: IC10.25(DAC1_OUT)
B_HE_THROTTLE3: IC10.24(DAC2_OUT)
B_HE_THROTTLE4: IC10.20(DAC3_OUT)
B_HE_THROTTLE5: IC10.19(DAC4_OUT)
B_HE_THROTTLE6: IC10.18(DAC5_OUT)
B_HE_THROTTLE7: IC10.51(DAC6_OUT)
B_HE_THROTTLE8: IC10.52(DAC7_OUT)
CHB_DAC_NCNVT: IC10.3(~{CNVT}) TP12.1 ; port CHB_DAC_NCNVT
CHB_DAC_NDAV: IC10.2(~{DA}V) R11.1 TP8.1 ; port CHB_DAC_NDAV
CHB_DAC_NRST: IC10.1(~{RESET}) TP9.1 ; port CHB_DAC_NRST
CHB_I2C_SCL: IC10.5(SCL) TP13.1 ; port CHB_I2C_SCL
CHB_I2C_SDA: IC10.4(SDA) TP14.1 ; port CHB_I2C_SDA
CHB_NDSC_CLR0: IC10.17(~{DSCLR0}) TP11.1 ; port CHB_NDSC_CLR0
CHB_NDSC_CLR1: IC10.63(~{DSCLR1}) TP10.1 ; port CHB_NDSC_CLR1
NetC26_2: C26.2 IC10.31(ADC_REF_IN/CMP)
NetIC10_57: IC10.57(REF-OUT) IC10.58(REF-DAC)

Not connected (* = marked no-connect by the designer): IC10 13(GPIO0) 14(GPIO1) 15(GPIO2) 16(GPIO3) 27(D2-/GPIO6) 28(D2+/GPIO7) 29(D1-/GPIO4) 30(D1+/GPIO5) 33(CH0) 34(CH1) 35(CH2) 36(CH3) 37(CH4) 38(CH5) 39(CH6) 40(CH7) 41(CH8) 42(CH9) 43(CH10) 44(CH11) 45(CH12) 46(CH13) 47(CH14) 48 60(DAC10_OUT) 61(DAC11_OUT) 62(~{ALARM})

### Buses and harness runs
bus B_AP_THROTTLE[1..2] = port B_AP_THROTTLE[1..2]
bus B_HE_THROTTLE[1..8] = port B_HE_THROTTLE[1..8]

### Notes on the sheet
- I2C Addx = 0xC2,0xC3
- (near IC10) Use Internal Ref
- PCB COMPONENT DESCRIPTION
- LDL NUMBER
- Assembly Details
- Size
- Drawing File Name
- Revision
- http://rloop.org
- Scale
- A3
- Sheet Details
- N.T.S
- Sheet:
- Of:

### Library data of the parts
C17-C20 C24 C25 = 100n / 50V / 10% / SMD 0603: as C2 on sheet LPCB220 - BRAKE FAILSAFE; Value: 100n; FMEDA__FUNCTION_IN_SYSTEM: *; FMEDA__OPERATING__VOLTAGE_TYP: 3.3
C26 = 4.7uF / 25V / 10% / SMD 0805: as C16 on sheet LPCB220 - DAC A; FMEDA__OPERATING__VOLTAGE_MIN: 0; FMEDA__OPERATING__VOLTAGE_TYP: 0; FMEDA__FUNCTION_IN_SYSTEM: *
IC10 = AMC7812BSPAP: IC, ADC / DAC, SMD [LIC550]
R11 = 10K / 0.1W / 1% / SMD 0603: as R21 on sheet LPCB220 - WATCHDOG; Value: 10K; FMEDA__OPERATING__POWER_MIN: 0; FMEDA__OPERATING__VOLTAGE_MAX: 0; FMEDA__OPERATING__VOLTAGE_MIN: 0; FMEDA__OPERATING__VOLTAGE_TYP: 0; FMEDA__FUNCTION_IN_SYSTEM: *
TP8-TP14 = SMD_TP: as TP25 on sheet LPCB220 - BRAKE FAILSAFE; FMEDA__OPERATING__CURRENT_MIN: 0; FMEDA__OPERATING__CURRENT_TYP: 0; FMEDA__OPERATING__VOLTAGE_MIN: 0

## Sheet LPCB220 - IBEAM INTERFACE.SchDoc
size A3; Address1: Factory 10; Address2: 9-13 Dingley Avenue, Dandeong, VICTORIA 3175, AUSTRALIA; DocumentNumber: 9; Revision: 1; SheetNumber: 9; SheetTotal: 18; Lockie__PCB_SUB_ASSEMBLY: I-Beam Position Interface; Lockie__PCB_ASSEMBLY: Brake Control; Lockie__LDL: LPCB220; Lockie__PCB_DESCRIPTION: Redundant Stepper Node
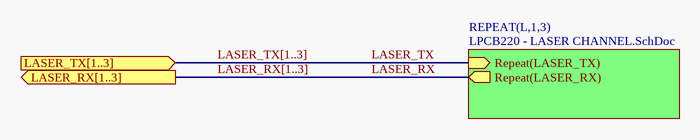
[diagram p9: LPCB220 - IBEAM INTERFACE.SchDoc]

### Sub-sheets
REPEAT(L,1,3) = LPCB220 - LASER CHANNEL.SchDoc: Repeat(LASER_RX) (out), Repeat(LASER_TX) (in)

### Ports
LASER_RX[1..3] (out), LASER_TX[1..3] (in)

### Nets
LASER_RX: sheet REPEAT(L,1,3)/Repeat(LASER_RX)
LASER_TX: sheet REPEAT(L,1,3)/Repeat(LASER_TX)

### Buses and harness runs
bus LASER_RX[1..3] = port LASER_RX[1..3]
bus LASER_TX[1..3] = port LASER_TX[1..3]

### Notes on the sheet
- PCB COMPONENT DESCRIPTION
- LDL NUMBER
- Assembly Details
- Size
- Drawing File Name
- Revision
- http://rloop.org
- Scale
- A3
- Sheet Details
- N.T.S
- Sheet:
- Of:

## Sheet LPCB220 - LASER CHANNEL.SchDoc
size A3; Address1: Factory 10; Address2: 9-13 Dingley Avenue, Dandeong, VICTORIA 3175, AUSTRALIA; DocumentNumber: 10; Revision: 1; SheetNumber: 10; SheetTotal: 18; Lockie__PCB_SUB_ASSEMBLY: Single I Beam Channel; Lockie__PCB_ASSEMBLY: Brake Control; Lockie__LDL: LPCB220; Lockie__PCB_DESCRIPTION: Redundant Stepper Node
Used 3 times, as channels U_LPCB220 - IBEAM INTERFACE/L1, U_LPCB220 - IBEAM INTERFACE/L2, U_LPCB220 - IBEAM INTERFACE/L3. Parts and nets are listed once, with the designators drawn on the sheet.
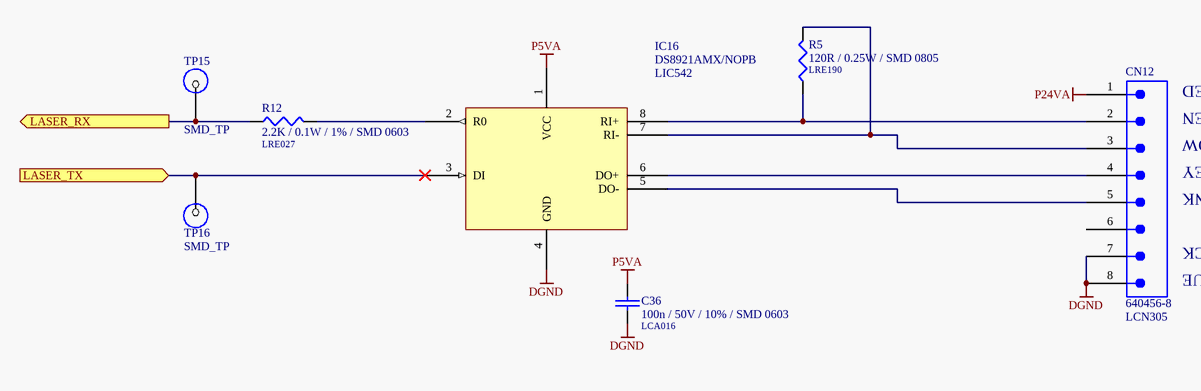
[diagram p10: LPCB220 - LASER CHANNEL.SchDoc]

### Parts
C36  100n / 50V / 10% / SMD 0603  LDL_NUMBER: LCA016  [LFP011__CC1608-0603-IPC7351_B]
CN12  640456-8  LDL_NUMBER: LCN305  [640456-8]
IC16  DS8921AMX/NOPB  LDL_NUMBER: LIC542  [LFP069__R-8G]
R5  120R / 0.25W / SMD 0805  LDL_NUMBER: LRE190  [LFP029__CR2012-0805]
R12  2.2K / 0.1W / 1% / SMD 0603  LDL_NUMBER: LRE027  [LFP020__CR1608-0603-IPC7351_B]
TP15  SMD_TP  [SMD-TP]  (no BOM)
TP16  SMD_TP  [SMD-TP]  (no BOM)

### Ports
LASER_RX (out), LASER_TX (in)

### Nets
DGND: C36.2 CN12.7 CN12.8 IC16.4(GND)
P5VA: C36.1 IC16.1(VCC)
P24VA: CN12.1
LASER_RX: R12.1 TP15.1 ; port LASER_RX
LASER_TX: IC16.3(DI) TP16.1 ; port LASER_TX
NetCN12_2: CN12.2 IC16.8(RI+) R5.1
NetCN12_3: CN12.3 IC16.7(RI-) R5.2
NetCN12_4: CN12.4 IC16.6(DO+)
NetCN12_5: CN12.5 IC16.5(DO-)
NetIC16_2: IC16.2(R0) R12.2

Not connected (* = marked no-connect by the designer): CN12 6

### Channels
U_LPCB220 - IBEAM INTERFACE/L1: designators end in _L1; ports LASER_RX=LASER_RX1 LASER_TX=LASER_TX1
U_LPCB220 - IBEAM INTERFACE/L2: designators end in _L2; ports LASER_RX=LASER_RX2 LASER_TX=LASER_TX2
U_LPCB220 - IBEAM INTERFACE/L3: designators end in _L3; ports LASER_RX=LASER_RX3 LASER_TX=LASER_TX3

### Notes on the sheet
- RED
- GREEN
- YELLOW
- GREY
- PINK
- BLACK
- BLUE
- PCB COMPONENT DESCRIPTION
- LDL NUMBER
- Assembly Details
- Size
- Drawing File Name
- Revision
- http://rloop.org
- Scale
- A3
- Sheet Details
- N.T.S
- Sheet:
- Of:

### Library data of the parts
C36 = 100n / 50V / 10% / SMD 0603: as C2 on sheet LPCB220 - BRAKE FAILSAFE; Value: 100n; FMEDA__FUNCTION_IN_SYSTEM: *; FMEDA__OPERATING__VOLTAGE_TYP: 3.3
CN12 = 640456-8: as CN7 on sheet LPCB220 - BRAKE FAILSAFE; FMEDA__FUNCTION_IN_SYSTEM: *; FMEDA__OPERATING__CURRENT_MIN: 0; FMEDA__OPERATING__CURRENT_TYP: 0; FMEDA__OPERATING__VOLTAGE_MIN: 0
IC16 = DS8921AMX/NOPB: IC, RS422 Tx Rx, SMD SOIC 8
R5 = 120R / 0.25W / SMD 0805: Resistor, Thick Film, 120R, 0.25W, 5%, SMD 0805 [LRE190]; Value: 120; FMEDA__OPERATING__POWER_MAX: 0; FMEDA__OPERATING__TEMP_MAX: 155; FMEDA__OPERATING__TEMP_MIN: -55; FMEDA__OPERATING__TEMP_TYP: 27; FMEDA__OPERATING__VOLTAGE_TYP: 150; FMEDA__CHANNEL: COM; FMEDA__OPERATING__POWER_MIN: 0; FMEDA__OPERATING__VOLTAGE_MAX: 0; FMEDA__OPERATING__VOLTAGE_MIN: 0; FMEDA__FUNCTION_IN_SYSTEM: *
R12 = 2.2K / 0.1W / 1% / SMD 0603: Resistor, Ceramic Chip, 2.2K, 0.1W, 1%, SMD 0603 [LRE027]; FMEDA__OPERATING__VOLTAGE_MIN: 0; FMEDA__OPERATING__TEMP_MIN: -20; FMEDA__OPERATING__TEMP_TYP: 27; FMEDA__OPERATING__TEMP_MAX: 50; FMEDA__CHANNEL: COM; VALUE: 2.2K; FMEDA__OPERATING__VOLTAGE_MAX: 0; FMEDA__OPERATING__POWER_MIN: 0; FMEDA__OPERATING__POWER_MAX: 0; FMEDA__FUNCTION_IN_SYSTEM: *; FMEDA__OPERATING__VOLTAGE_TYP: 0
TP15 TP16 = SMD_TP: as TP25 on sheet LPCB220 - BRAKE FAILSAFE; FMEDA__OPERATING__CURRENT_MIN: 0; FMEDA__OPERATING__CURRENT_TYP: 0; FMEDA__OPERATING__VOLTAGE_MIN: 0

## Sheet LPCB220 - CORE A.SchDoc
size A3; Address1: Factory 10; Address2: 9-13 Dingley Avenue, Dandeong, VICTORIA 3175, AUSTRALIA; DocumentNumber: 4; Revision: 1; SheetNumber: 4; SheetTotal: 18; Lockie__PCB_SUB_ASSEMBLY: Node Core A; Lockie__PCB_ASSEMBLY: Brake Control; Lockie__LDL: LPCB220; Lockie__PCB_DESCRIPTION: Redundant Stepper Node
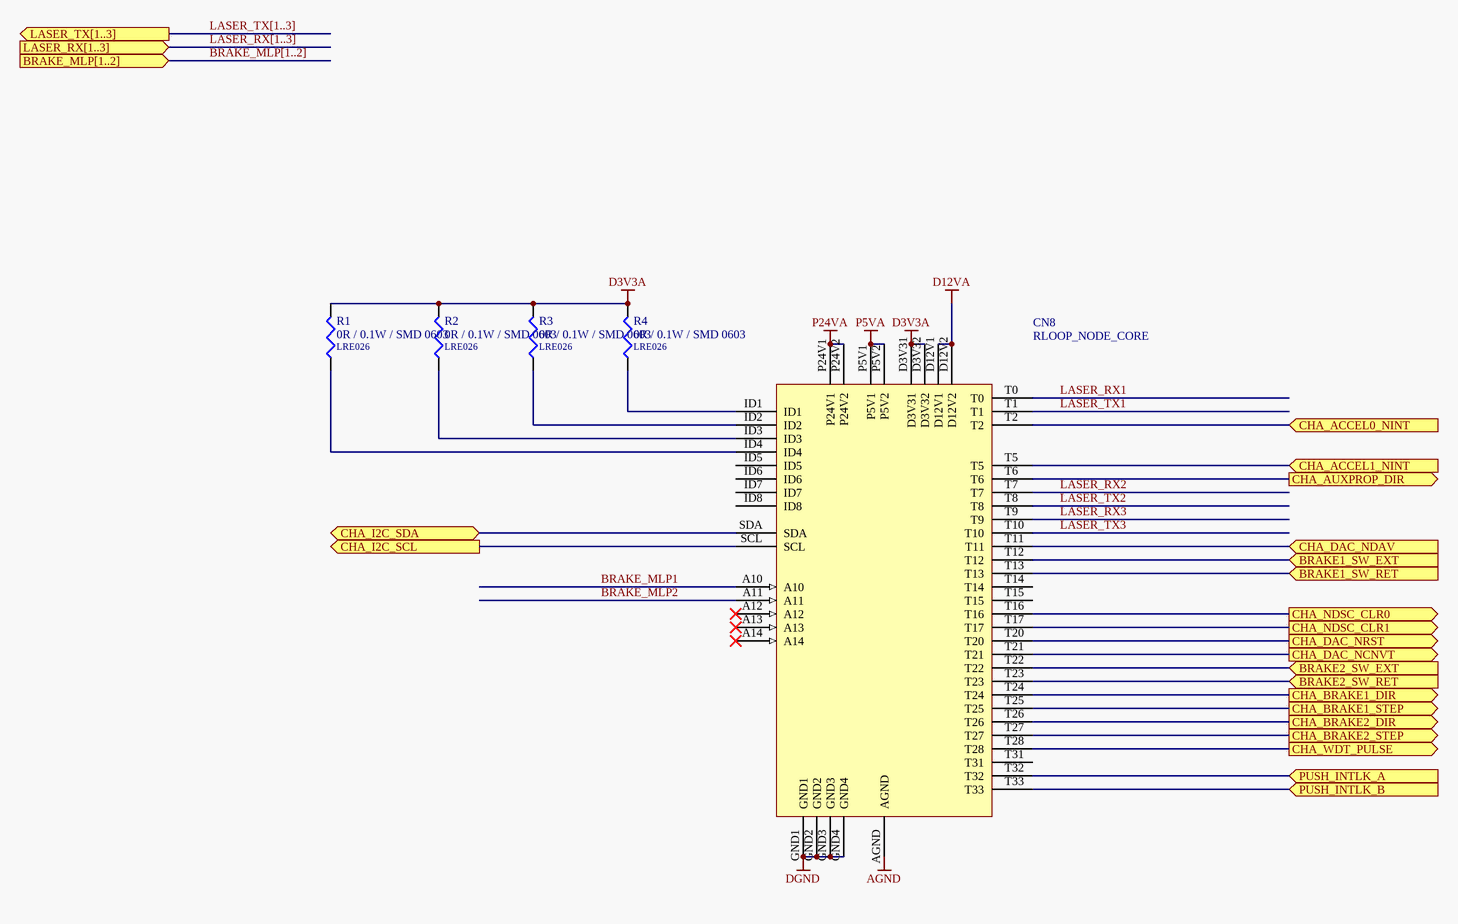
[diagram p11: LPCB220 - CORE A.SchDoc]

### Parts
CN8  RLOOP_NODE_CORE  [RLOOP_NODE_CORE]  (no BOM)
R1  0R / 0.1W / SMD 0603  LDL_NUMBER: LRE026  [LFP020__CR1608-0603-IPC7351_B]
R2  0R / 0.1W / SMD 0603  LDL_NUMBER: LRE026  [LFP020__CR1608-0603-IPC7351_B]
R3  0R / 0.1W / SMD 0603  LDL_NUMBER: LRE026  [LFP020__CR1608-0603-IPC7351_B]
R4  0R / 0.1W / SMD 0603  LDL_NUMBER: LRE026  [LFP020__CR1608-0603-IPC7351_B]

### Ports
BRAKE1_SW_EXT (in), BRAKE1_SW_RET (in), BRAKE2_SW_EXT (in), BRAKE2_SW_RET (in), BRAKE_MLP[1..2] (in), CHA_ACCEL0_NINT (in), CHA_ACCEL1_NINT (in), CHA_AUXPROP_DIR (out), CHA_BRAKE1_DIR (out), CHA_BRAKE1_STEP (out), CHA_BRAKE2_DIR (out), CHA_BRAKE2_STEP (out), CHA_DAC_NCNVT (out), CHA_DAC_NDAV (in), CHA_DAC_NRST (out), CHA_I2C_SCL (out), CHA_I2C_SDA (bidir), CHA_NDSC_CLR0 (out), CHA_NDSC_CLR1 (out), CHA_WDT_PULSE (out), LASER_RX[1..3] (in), LASER_TX[1..3] (out), PUSH_INTLK_A (in), PUSH_INTLK_B (in)

### Nets
AGND: CN8.AGND
D3V3A: CN8.D3V31 CN8.D3V32 R1.2 R2.2 R3.2 R4.2
D12VA: CN8.D12V1 CN8.D12V2
DGND: CN8.GND1 CN8.GND2 CN8.GND3 CN8.GND4
P5VA: CN8.P5V1 CN8.P5V2
P24VA: CN8.P24V1 CN8.P24V2
BRAKE1_SW_EXT: CN8.T12 ; port BRAKE1_SW_EXT
BRAKE1_SW_RET: CN8.T13 ; port BRAKE1_SW_RET
BRAKE2_SW_EXT: CN8.T22 ; port BRAKE2_SW_EXT
BRAKE2_SW_RET: CN8.T23 ; port BRAKE2_SW_RET
BRAKE_MLP1: CN8.A10
BRAKE_MLP2: CN8.A11
CHA_ACCEL0_NINT: CN8.T2 ; port CHA_ACCEL0_NINT
CHA_ACCEL1_NINT: CN8.T5 ; port CHA_ACCEL1_NINT
CHA_AUXPROP_DIR: CN8.T6 ; port CHA_AUXPROP_DIR
CHA_BRAKE1_DIR: CN8.T24 ; port CHA_BRAKE1_DIR
CHA_BRAKE1_STEP: CN8.T25 ; port CHA_BRAKE1_STEP
CHA_BRAKE2_DIR: CN8.T26 ; port CHA_BRAKE2_DIR
CHA_BRAKE2_STEP: CN8.T27 ; port CHA_BRAKE2_STEP
CHA_DAC_NCNVT: CN8.T21 ; port CHA_DAC_NCNVT
CHA_DAC_NDAV: CN8.T11 ; port CHA_DAC_NDAV
CHA_DAC_NRST: CN8.T20 ; port CHA_DAC_NRST
CHA_I2C_SCL: CN8.SCL ; port CHA_I2C_SCL
CHA_I2C_SDA: CN8.SDA ; port CHA_I2C_SDA
CHA_NDSC_CLR0: CN8.T16 ; port CHA_NDSC_CLR0
CHA_NDSC_CLR1: CN8.T17 ; port CHA_NDSC_CLR1
CHA_WDT_PULSE: CN8.T28 ; port CHA_WDT_PULSE
LASER_RX1: CN8.T0
LASER_RX2: CN8.T7
LASER_RX3: CN8.T9
LASER_TX1: CN8.T1
LASER_TX2: CN8.T8
LASER_TX3: CN8.T10
PUSH_INTLK_A: CN8.T32 ; port PUSH_INTLK_A
PUSH_INTLK_B: CN8.T33 ; port PUSH_INTLK_B
NetCN8_ID1: CN8.ID1 R4.1
NetCN8_ID2: CN8.ID2 R3.1
NetCN8_ID3: CN8.ID3 R2.1
NetCN8_ID4: CN8.ID4 R1.1

Not connected (* = marked no-connect by the designer): CN8 A12* A13* A14* ID5 ID6 ID7 ID8 T14 T15 T31

### Buses and harness runs
bus BRAKE_MLP[1..2] = port BRAKE_MLP[1..2]
bus LASER_RX[1..3] = port LASER_RX[1..3]
bus LASER_TX[1..3] = port LASER_TX[1..3]

### Notes on the sheet
- PCB COMPONENT DESCRIPTION
- LDL NUMBER
- Assembly Details
- Size
- Drawing File Name
- Revision
- http://rloop.org
- Scale
- A3
- Sheet Details
- N.T.S
- Sheet:
- Of:

### Library data of the parts
CN8 = RLOOP_NODE_CORE: rLoop Node Core Connector; FMEDA__CHANNEL: COM; FMEDA__OPERATING__CURRENT_MAX: 0; FMEDA__OPERATING__TEMP_MAX: 50; FMEDA__OPERATING__TEMP_MIN: -20; FMEDA__OPERATING__TEMP_TYP: 27; FMEDA__OPERATING__VOLTAGE_MAX: 16; FMEDA__OPERATING__VOLTAGE_TYP: 12; FMEDA__OPERATING__CURRENT_MIN: 0; FMEDA__OPERATING__CURRENT_TYP: 0; FMEDA__OPERATING__VOLTAGE_MIN: 0
R1-R4 = 0R / 0.1W / SMD 0603: Resistor, Ceramic Chip, 0R, 0.1W, SMD 0603 [LRE026]; Value: 0; FMEDA__OPERATING__TEMP_MAX: 50; FMEDA__OPERATING__TEMP_MIN: -20; FMEDA__OPERATING__TEMP_TYP: 27; FMEDA__CHANNEL: COM; FMEDA__OPERATING__POWER_MAX: 0; FMEDA__OPERATING__POWER_MIN: 0; FMEDA__OPERATING__VOLTAGE_MAX: 0; FMEDA__OPERATING__VOLTAGE_MIN: 0; FMEDA__OPERATING__VOLTAGE_TYP: 0; FMEDA__FUNCTION_IN_SYSTEM: *